# Altium project Dahlia Carrier Board.PrjPcb (part 2 of 4)

## Sheet Power_Switch.SchDoc: Dahlia Carrier Board
size A3; Organization: Toradex AG; Address1: Ebenaustrasse 10; Address2: Horw; Address3: 6048; Address4: Switzerland; DocumentNumber: 4; Revision: V1.1; SheetNumber: 4; SheetTotal: 21; PageSetup: Record=PageOptions|CenterHorizontal=True|CenterVertical=True|PrintScale=0.71|XCorrection=1.00|YCorrection=1.00|PrintKind=1|BorderSize=5000000|LeftOffset=0|BottomOffset=0|Orientation=2|PaperLength=1000|PaperWidth=1000|Scale=100|PaperSource=15|PrintQuality=600|MediaType=1|DitherType=10|PaperKind=A4|PrintScaleMode=1
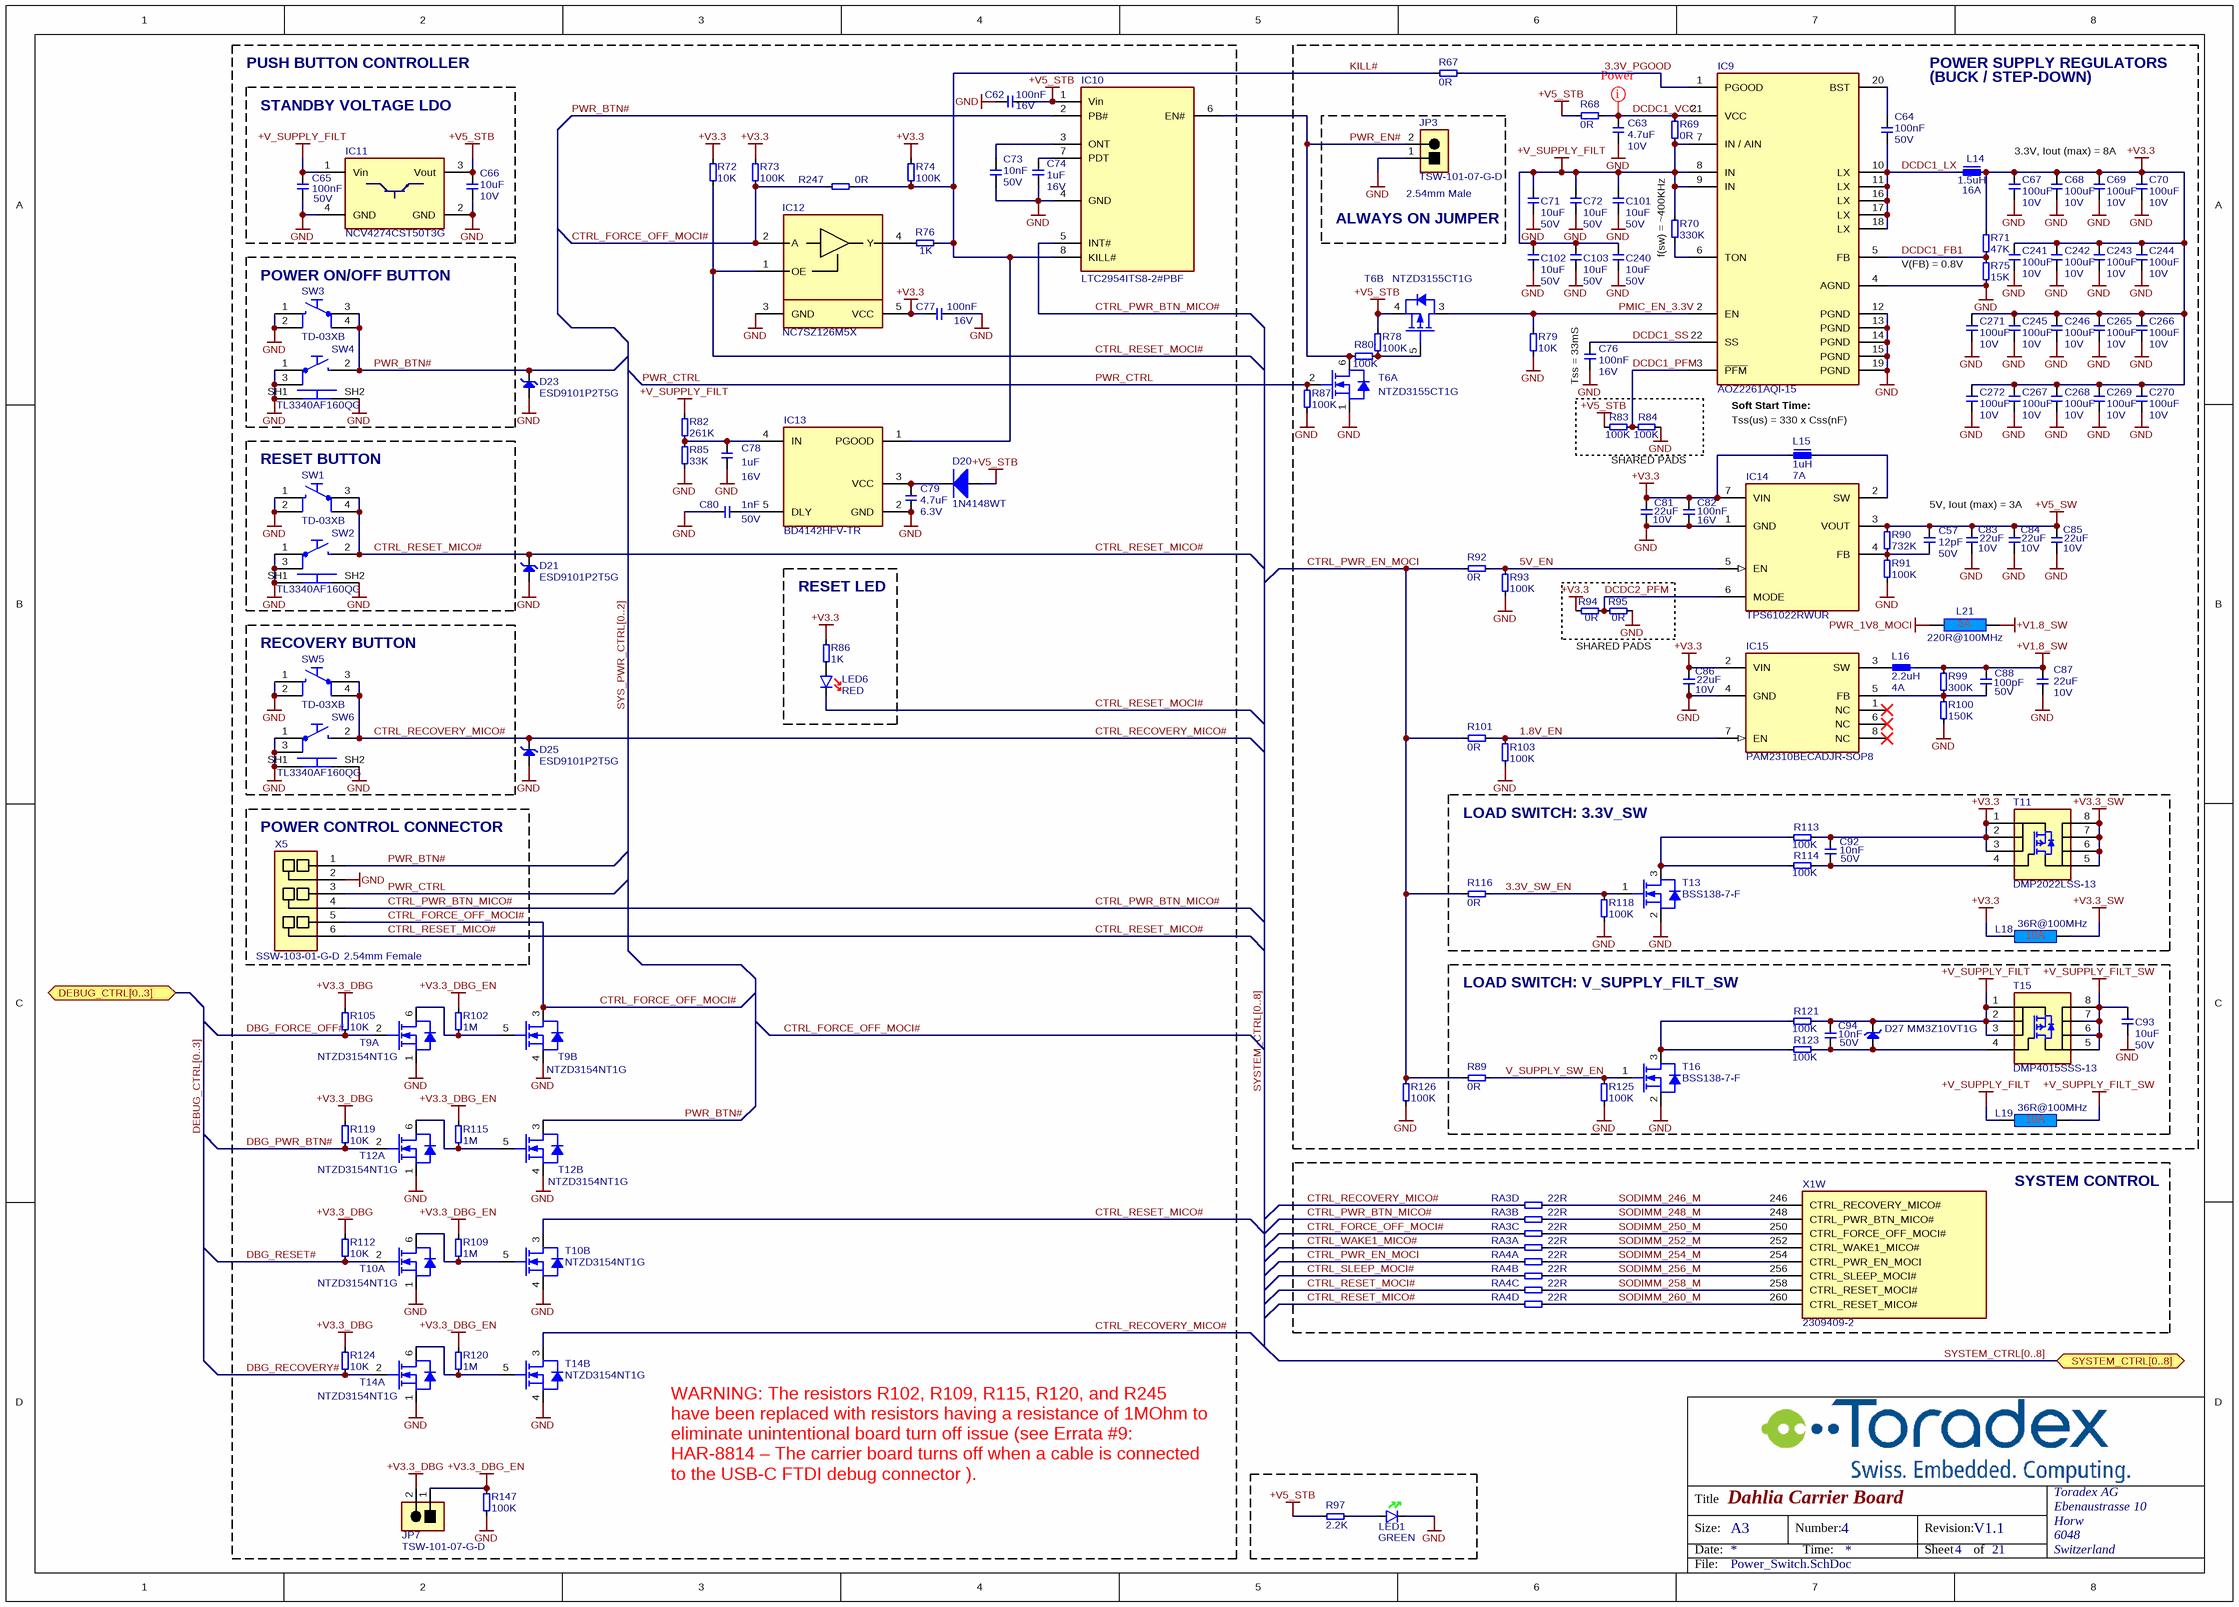
[diagram p6: Power_Switch.SchDoc]

### Parts
C57  Rating: 50V  [CAPC1005X60N]  (hidden comment: 12pF)
C62  Rating: 16V  [CAPC1005X60N]  (hidden comment: 100nF)
C63  Rating: 10V  [T_CAPC0603X33N]  (hidden comment: 4.7uF)
C64  Rating: 50V  [CAPC1005X60N]  (hidden comment: 100nF)
C65  Rating: 50V  [CAPC1005X60N]  (hidden comment: 100nF)
C66  Rating: 10V  [T_CAPC0603X33N]  (hidden comment: 10uF)
C67  Rating: 10V  [T_CAPC1206X60N]  (hidden comment: 100uF)
C68  Rating: 10V  [T_CAPC1206X60N]  (hidden comment: 100uF)
C69  Rating: 10V  [T_CAPC1206X60N]  (hidden comment: 100uF)
C70  Rating: 10V  [T_CAPC1206X60N]  (hidden comment: 100uF)
C71  Rating: 50V  [T_CAPC1206X60N]  (hidden comment: 10uF)
C72  Rating: 50V  [T_CAPC1206X60N]  (hidden comment: 10uF)
C73  Rating: 50V  [CAPC1005X60N]  (hidden comment: 10nF)
C74  Rating: 16V  [CAPC1005X60N]  (hidden comment: 1uF)
C76  Rating: 16V  [CAPC1005X60N]  (hidden comment: 100nF)
C77  Rating: 16V  [CAPC1005X60N]  (hidden comment: 100nF)
C78  Rating: 16V  [CAPC1005X60N]  (hidden comment: 1uF)
C79  Rating: 6.3V  [CAPC1005X60N]  (hidden comment: 4.7uF)
C80  Rating: 50V  [CAPC1005X60N]  (hidden comment: 1nF)
C81  Rating: 10V  [T_CAPC0805X125N]  (hidden comment: 22uF)
C82  Rating: 16V  [CAPC1005X60N]  (hidden comment: 100nF)
C83  Rating: 10V  [T_CAPC0805X125N]  (hidden comment: 22uF)
C84  Rating: 10V  [T_CAPC0805X125N]  (hidden comment: 22uF)
C85  Rating: 10V  [T_CAPC0805X125N]  (hidden comment: 22uF)
C86  Rating: 10V  [T_CAPC0805X125N]  (hidden comment: 22uF)
C87  Rating: 10V  [T_CAPC0805X125N]  (hidden comment: 22uF)
C88  Rating: 50V  [CAPC1005X60N]  (hidden comment: 100pF)
C92  Rating: 50V  [CAPC1005X60N]  (hidden comment: 10nF)
C93  Rating: 50V  [T_CAPC1206X60N]  (hidden comment: 10uF)
C94  Rating: 50V  [CAPC1005X60N]  (hidden comment: 10nF)
C101  Rating: 50V  [T_CAPC1206X60N]  (hidden comment: 10uF)
C102  Rating: 50V  [T_CAPC1206X60N]  (hidden comment: 10uF)
C103  Rating: 50V  [T_CAPC1206X60N]  (hidden comment: 10uF)
C240  Rating: 50V  [T_CAPC1206X60N]  (hidden comment: 10uF)
C241  Rating: 10V  [T_CAPC1206X60N]  (hidden comment: 100uF)
C242  Rating: 10V  [T_CAPC1206X60N]  (hidden comment: 100uF)
C243  Rating: 10V  [T_CAPC1206X60N]  (hidden comment: 100uF)
C244  Rating: 10V  [T_CAPC1206X60N]  (hidden comment: 100uF)
C245  Rating: 10V  [T_CAPC1206X60N]  (hidden comment: 100uF)
C246  Rating: 10V  [T_CAPC1206X60N]  (hidden comment: 100uF)
C265  Rating: 10V  [T_CAPC1206X60N]  (hidden comment: 100uF)
C266  Rating: 10V  [T_CAPC1206X60N]  (hidden comment: 100uF)
C267  Rating: 10V  [T_CAPC1206X60N]  (hidden comment: 100uF)
C268  Rating: 10V  [T_CAPC1206X60N]  (hidden comment: 100uF)
C269  Rating: 10V  [T_CAPC1206X60N]  (hidden comment: 100uF)
C270  Rating: 10V  [T_CAPC1206X60N]  (hidden comment: 100uF)
C271  Rating: 10V  [T_CAPC1206X60N]  (hidden comment: 100uF)
C272  Rating: 10V  [T_CAPC1206X60N]  (hidden comment: 100uF)
D20  1N4148WT  [SOD-523F]
D21  ESD9101P2T5G  [SOD-923]
D23  ESD9101P2T5G  [SOD-923]
D25  ESD9101P2T5G  [SOD-923]
D27  MM3Z10VT1G  [T_SOD-323]
IC9  AOZ2261AQI-15  [T_QFN50P400X400X100-22N]
IC10  LTC2954ITS8-2#PBF  [T_LINEAR_LTC2954CTS8-2#PBF]
IC11  NCV4274CST50T3G  [T_ON_NCV4264-2ST50T3G]
IC12  NC7SZ126M5X  [SOT95P279X142-5N]
IC13  BD4142HFV-TR  [IC-Rohm-BD4142HFV-TR]
IC14  TPS61022RWUR  [T_TI_TPS61022RWUR]
IC15  Manufacturer Part No.: PAM2310BECADJR-SOP8  [IC-SO-8EP]  (hidden comment: PAM2310BECADJR)
JP3  TSW-101-07-G-D  [T_Samtec_TSW-101-07-G-D]
JP7  TSW-101-07-G-D  [T_Samtec_TSW-101-07-G-D]
L14  Rating: 16A  [T_INDM110100]  (hidden comment: 1.5uH)
L15  Rating: 7A  [T_INDM_PA4340]  (hidden comment: 1uH)
L16  Rating: 4A  [IND-BOURNS-SRP4020TA]  (hidden comment: 2.2uH)
L18  36R@100MHz  [T_Laird_35F0121-0SR-10]
L19  36R@100MHz  [T_Laird_35F0121-0SR-10]
L21  220R@100MHz  [INDC1608X95N]
LED1  Color: GREEN  [T_Liteon_LTST-C190GKT]  (hidden comment: LTST-C190GKT)
LED6  Color: RED  [T_Liteon_LTST-C190KRKT]  (hidden comment: LTST-C190KRKT)
R67  0R  [T_RESC0603X30N]
R68  0R  [T_RESC0603X30N]
R69  0R  [T_RESC0603X30N]
R70  330K  [RESC1005X40N]
R71  47K  [RESC1005X40N]
R72  10K  [RESC1005X40N]
R73  100K  [RESC1005X40N]
R74  100K  [RESC1005X40N]
R75  15K  [RESC1005X40N]
R76  1K  [RESC1005X40N]
R78  100K  [RESC1005X40N]
R79  10K  [RESC1005X40N]
R80  100K  [RESC1005X40N]
R82  261K  [RESC1005X40N]
R83  100K  [T_RESC0603X30N]
R84  100K  [T_RESC0603X30N]
R85  33K  [RESC1005X40N]
R86  1K  [RESC1005X40N]
R87  100K  [RESC1005X40N]
R89  0R  [T_RESC0603X30N]
R90  732K  [RESC1005X40N]
R91  100K  [RESC1005X40N]
R92  0R  [T_RESC0603X30N]
R93  100K  [RESC1005X40N]
R94  0R  [T_RESC0603X30N]
R95  0R  [T_RESC0603X30N]
R97  2.2K  [RESC1005X40N]
R99  300K  [RESC1005X40N]
R100  150K  [RESC1005X40N]
R101  0R  [T_RESC0603X30N]
R102  1M  [RESC1005X40N]
R103  100K  [RESC1005X40N]
R105  10K  [RESC1005X40N]
R109  1M  [RESC1005X40N]
R112  10K  [RESC1005X40N]
R113  100K  [RESC1005X40N]
R114  100K  [RESC1005X40N]
R115  1M  [RESC1005X40N]
R116  0R  [T_RESC0603X30N]
R118  100K  [RESC1005X40N]
R119  10K  [RESC1005X40N]
R120  1M  [RESC1005X40N]
R121  100K  [RESC1005X40N]
R123  100K  [RESC1005X40N]
R124  10K  [RESC1005X40N]
R125  100K  [RESC1005X40N]
R126  100K  [RESC1005X40N]
R147  100K  [RESC1005X40N]
R247  0R  [T_RESC0603X30N]
RA3  22R  [T_Resistor_Array_X4]  (parts A,B,C,D of 4)
RA4  22R  [T_Resistor_Array_X4]  (parts A,B,C,D of 4)
SW1  TD-03XB  [T_WMF_TD-03XB]
SW2  TL3340AF160QG  [T_E-SWITCH- TL3340AF160QG]
SW3  TD-03XB  [T_WMF_TD-03XB]
SW4  TL3340AF160QG  [T_E-SWITCH- TL3340AF160QG]
SW5  TD-03XB  [T_WMF_TD-03XB]
SW6  TL3340AF160QG  [T_E-SWITCH- TL3340AF160QG]
T6  NTZD3155CT1G  [SOTFL50P160X60-6N]  (parts A,B of 2)
T9  Manufacturer Part No.: NTZD3154NT1G  [SOTFL50P160X60-6N]  (hidden comment: T-ONSemi-NTZD3154NT1G)  (parts A,B of 2)
T10  Manufacturer Part No.: NTZD3154NT1G  [SOTFL50P160X60-6N]  (hidden comment: T-ONSemi-NTZD3154NT1G)  (parts A,B of 2)
T11  DMP2022LSS-13  [SOIC127P600X173-8N]
T12  Manufacturer Part No.: NTZD3154NT1G  [SOTFL50P160X60-6N]  (hidden comment: T-ONSemi-NTZD3154NT1G)  (parts A,B of 2)
T13  BSS138-7-F  [SOT95P237X112-3N]
T14  Manufacturer Part No.: NTZD3154NT1G  [SOTFL50P160X60-6N]  (hidden comment: T-ONSemi-NTZD3154NT1G)  (parts A,B of 2)
T15  DMP4015SSS-13  [SOIC127P600X173-8N]
T16  BSS138-7-F  [SOT95P237X112-3N]
X1  2309409-2  [CON-TE-2309409-2-SOLDERABLE-STANDOFFS]  (part W of 23)
X5  Manufacturer Part No.: SSW-103-01-G-D  [T_Samtec_SSW-103-01-G-D]  (hidden comment: TSW-103-01-G-D)

### Blocks framed on the sheet
ALWAYS ON JUMPER: JP3
POWER ON/OFF BUTTON: SW3 SW4
Tss = 33mS: R83 R84
RESET BUTTON: SW1 SW2
RESET LED: LED6 R86
RECOVERY BUTTON: SW5 SW6
POWER CONTROL CONNECTOR: X5
LOAD SWITCH: 3.3V_SW: C92 L18 R113 R114 R116 R118 T11 T13
LOAD SWITCH: V_SUPPLY_FILT_SW: C93 C94 D27 L19 R89 R121 R123 R125 T15 T16
SYSTEM CONTROL: RA3 RA4 X1

### Ports
DEBUG_CTRL[0..3] (bidir), SYSTEM_CTRL[0..8] (bidir)

### Nets
+V1.8_SW: C87.2 C88.2 L16.2 L21.2 R99.2
+V3.3: C67.2 C68.2 C69.2 C70.2 C77.1 C81.2 C82.2 C86.2 C92.2 C241.2 C242.2 C243.2 C244.2 C245.2 C246.2 C265.2 C266.2 C267.2 C268.2 C269.2 C270.2 C271.2 C272.2 IC12.5(VCC) IC14.7(VIN) IC15.2(VIN) L14.2 L15.1 L18.1 R71.2 R72.2 R73.2 R74.2 R86.2 R94.1 R113.2 T11.1(S) T11.2(S) T11.3(S)
+V3.3_DBG: JP7.2 R105.2 R112.2 R119.2 R124.2
+V3.3_DBG_EN: JP7.1 R102.2 R109.2 R115.2 R120.2 R147.2
+V3.3_SW: L18.2 T11.5(D) T11.6(D) T11.7(D) T11.8(D)
+V5_STB: C62.2 C66.2 D20.A IC10.1(Vin) IC11.3(Vout) R68.1 R78.1 R83.1 R97.2 T6.4(S)
+V5_SW: C57.1 C83.2 C84.2 C85.2 IC14.3(VOUT) R90.2
+V_SUPPLY_FILT: C65.2 C71.2 C72.2 C94.2 C101.2 C102.2 C103.2 C240.2 D27.1(C) IC9.7(IN_/_AIN) IC9.8(IN) IC9.9(IN) IC11.1(Vin) L19.1 R69.2 R70.2 R82.2 R121.2 T15.1(S) T15.2(S) T15.3(S)
+V_SUPPLY_FILT_SW: C93.2 L19.2 T15.5(D) T15.6(D) T15.7(D) T15.8(D)
GND: C62.1 C63.1 C65.1 C66.1 C67.1 C68.1 C69.1 C70.1 C71.1 C72.1 C73.1 C74.1 C76.1 C77.2 C78.1 C79.1 C80.1 C81.1 C82.1 C83.1 C84.1 C85.1 C86.1 C87.1 C93.1 C101.1 C102.1 C103.1 C240.1 C241.1 C242.1 C243.1 C244.1 C245.1 C246.1 C265.1 C266.1 C267.1 C268.1 C269.1 C270.1 C271.1 C272.1 D21.2(A) D23.2(A) D25.2(A) IC9.4(AGND) IC9.12(PGND) IC9.13(PGND) IC9.14(PGND) IC9.15(PGND) IC9.19(PGND) IC10.4(GND) IC11.2(GND) IC11.4(GND) IC12.3(GND) IC13.2(GND) IC14.1(GND) IC15.4(GND) JP3.1 LED1.K R75.1 R79.1 R84.2 R85.1 R87.1 R91.1 R93.1 R95.2 R100.1 R103.1 R118.1 R125.1 R126.1 R147.1 SW1.1 SW1.2 SW2.1 SW2.3 SW2.SH1 SW2.SH2 SW3.1 SW3.2 SW4.1 SW4.3 SW4.SH1 SW4.SH2 SW5.1 SW5.2 SW6.1 SW6.3 SW6.SH1 SW6.SH2 T6.1(S) T9.1(S) T9.4(S) T10.1(S) T10.4(S) T12.1(S) T12.4(S) T13.2(S) T14.1(S) T14.4(S) T16.2(S) X5.2
PWR_1V8_MOCI: L21.1
1.8V_EN: IC15.7(EN) R101.2 R103.2
3.3V_PGOOD: IC9.1(PGOOD) R67.2
3.3V_SW_EN: R116.2 R118.2 T13.1(G)
5V_EN: IC14.5(EN) R92.2 R93.2
CTRL_FORCE_OFF_MOCI#: IC12.2(A) R73.1 R247.1 RA3.7 T9.3(D) X5.5
CTRL_PWR_BTN_MICO#: IC10.5(INT#) RA3.6 X5.4
CTRL_PWR_EN_MOCI: R89.1 R92.1 R101.1 R116.1 R126.2 RA4.5
CTRL_RECOVERY_MICO#: D25.1(C) RA3.8 SW5.3 SW5.4 SW6.2 T14.3(D)
CTRL_RESET_MICO#: D21.1(C) RA4.8 SW1.3 SW1.4 SW2.2 T10.3(D) X5.6
CTRL_RESET_MOCI#: IC12.1(OE) LED6.K R72.1 RA4.7
CTRL_SLEEP_MOCI#: RA4.6
CTRL_WAKE1_MICO#: RA3.5
DBG_FORCE_OFF#: R105.1 T9.2(G)
DBG_PWR_BTN#: R119.1 T12.2(G)
DBG_RECOVERY#: R124.1 T14.2(G)
DBG_RESET#: R112.1 T10.2(G)
DCDC1_FB1: IC9.5(FB) R71.1 R75.2
DCDC1_LX: C64.1 IC9.10(LX) IC9.11(LX) IC9.16(LX) IC9.17(LX) IC9.18(LX) L14.1
DCDC1_PFM: IC9.3(~{PFM}) R83.2 R84.1
DCDC1_SS: C76.2 IC9.22(SS)
DCDC1_VCC: C63.2 IC9.21(VCC) R68.2 R69.1
DCDC2_PFM: IC14.6(MODE) R94.2 R95.1
KILL#: IC10.8(KILL#) IC13.1(PGOOD) R67.1 R74.1 R76.2 R247.2
PMIC_EN_3.3V: IC9.2(EN) R79.2 T6.3(D)
PWR_BTN#: D23.1(C) IC10.2(PB#) SW3.3 SW3.4 SW4.2 T12.3(D) X5.1
PWR_CTRL: R87.2 T6.2(G) X5.3
PWR_EN#: IC10.6(EN#) JP3.2 R80.1 T6.6(D)
SODIMM_246_M: RA3.4 X1.246(CTRL_RECOVERY_MICO#)
SODIMM_248_M: RA3.2 X1.248(CTRL_PWR_BTN_MICO#)
SODIMM_250_M: RA3.3 X1.250(CTRL_FORCE_OFF_MOCI#)
SODIMM_252_M: RA3.1 X1.252(CTRL_WAKE1_MICO#)
SODIMM_254_M: RA4.1 X1.254(CTRL_PWR_EN_MOCI)
SODIMM_256_M: RA4.2 X1.256(CTRL_SLEEP_MOCI#)
SODIMM_258_M: RA4.3 X1.258(CTRL_RESET_MOCI#)
SODIMM_260_M: RA4.4 X1.260(CTRL_RESET_MICO#)
V_SUPPLY_SW_EN: R89.2 R125.2 T16.1(G)
NetC57_2: C57.2 IC14.4(FB) R90.1 R91.2
NetC64_2: C64.2 IC9.20(BST)
NetC73_2: C73.2 IC10.3(ONT)
NetC74_2: C74.2 IC10.7(PDT)
NetC78_2: C78.2 IC13.4(IN) R82.1 R85.2
NetC79_2: C79.2 D20.C IC13.3(VCC)
NetC80_2: C80.2 IC13.5(DLY)
NetC88_1: C88.1 IC15.5(FB) R99.1 R100.2
NetC92_1: C92.1 R114.2 T11.4(G)
NetC94_1: C94.1 D27.2(A) R123.2 T15.4(G)
NetIC9_6: IC9.6(TON) R70.1
NetIC12_4: IC12.4(Y) R76.1
NetIC14_2: IC14.2(SW) L15.2
NetIC15_3: IC15.3(SW) L16.1
NetLED1_A: LED1.A R97.1
NetLED6_A: LED6.A R86.1
NetR78_2: R78.2 R80.2 T6.5(G)
NetR102_1: R102.1 T9.5(G) T9.6(D)
NetR109_1: R109.1 T10.5(G) T10.6(D)
NetR113_1: R113.1 R114.1 T13.3(D)
NetR115_1: R115.1 T12.5(G) T12.6(D)
NetR120_1: R120.1 T14.5(G) T14.6(D)
NetR121_1: R121.1 R123.1 T16.3(D)

Not connected (* = marked no-connect by the designer): IC15 1(NC)* 6(NC)* 8(NC)*

### Buses and harness runs
bus DEBUG_CTRL[0..3] = port DEBUG_CTRL[0..3]
bus SYS_PWR_CTRL[0..2]
bus SYSTEM_CTRL[0..8] = port SYSTEM_CTRL[0..8]

### Layout directives
net class Power: DCDC1_VCC

### Notes on the sheet
- PUSH BUTTON CONTROLLER
- STANDBY VOLTAGE LDO
- POWER SUPPLY REGULATORS
- (BUCK / STEP-DOWN)
- 3.3V, Iout (max) = 8A
- (near JP3) 2.54mm Male
- (near R70) f(sw) = ~400KHz
- V(FB) = 0.8V
- Soft Start Time:
- SHARED PADS
- Tss(us) = 330 x Css(nF)
- 5V, Iout (max) = 3A
- 2.54mm Female
- WARNING: The resistors R102, R109, R115, R120, and R245 have been replaced with resistors having a resistance of 1MOhm to eliminate unintentional board turn off issue (see Errata #9: HAR-8814 – The carrier board turns off when a cable is connected to the USB-C FTDI debug connector ).
- Title
- Size:
- Date:
- A3
- Number:
- Time:
- Revision:
- Sheet
- of
- File:

### Library data of the parts
C57 = C-NP0-12p-50V-5%-0402: Capacitor Ceramic NP0  12pF 50V 5% 0402; Tolerance: 5%; Type: NP0; Value: 12pF
C62 C76 C77 C82 = C-X7R-100nF-16V-10%-0402: Capacitor Ceramic X7R 100nF 16V 10% 0402; Tolerance: 10%; Type: X7R; Value: 100nF
C63 = C-X5R-4.7uF-10V-10%-0603: Capacitor Ceramic X5R 4.7uF 10V 10% 0603; Tolerance: 10%; Type: X5R; Value: 4.7uF
C64 C65 = C-X7R-100nF-50V-10%-0402: Capacitor Ceramic X7R 100nF 50V 10% 0402; Tolerance: 10%; Type: X7R; Value: 100nF
C66 = C-X5R-10uF-10V-20%-0603: Capacitor Ceramic X5R 10uF 10V 20% 0603; Tolerance: 20%; Type: X5R; Value: 10uF
C67-C70 C241-C246 C265-C272 = C-X5R-100uF-10V-20%-1206: Capacitor Ceramic X5R 100uF 10V 20% 1206; Tolerance: 20%; Type: X5R; Value: 100uF
C71 C72 C93 C101-C103 C240 = C-X5R-10uF-50V-20%-1206: Capacitor Ceramic X5R 10uF 50V 20% 1206; Tolerance: 20%; Type: X5R; Value: 10uF
C73 C92 C94 = C-X7R-10nF-50V-10%-0402: Capacitor Ceramic X7R 10nF 50V 10% 0402; Tolerance: 10%; Type: X7R; Value: 10nF
C74 C78 = C-X5R-1uF-16V-20%-0402: Capacitor Ceramic X5R 1uF 16V 20% 0402; Tolerance: 20%; Type: X5R; Value: 1uF
C79 = C-X5R-4.7u-6.3V-20%-0402: Capacitor Ceramic X5R 4.7uF 6.3V 20% 0402; Tolerance: 20%; Type: X5R; Value: 4.7uF
C80 = C-X7R-1nF-50V-10%-0402: Capacitor Ceramic X7R 1nF 50V 10% 0402; Tolerance: 10%; Type: X7R; Value: 1nF
C81 C83-C87 = C-X5R-22uF-10V-20%-0805: Capacitor Ceramic X5R 22uF 10V 20% 0805; Tolerance: 20%; Type: X5R; Value: 22uF; ClassName: Power_Poly
C88 = C-X7R-100pF-50V-10%-0402: Capacitor Ceramic X7R 100pF 50V 10% 0402; Tolerance: 10%; Type: X7R; Value: 100pF
D20 = D-OnSemi-1N4148WT: Diode Standard 75V 200mA Surface Mount SOD-523F; Manufacturer Name: On Semi; Manufacturer Part No.: 1N4148WT
D21 D23 D25 = D-OnSemi-ESD9101P2T5G: ESD Protection Diode; Manufacturer Name: OnSemi; Manufacturer Part No.: ESD9101P2T5G
D27 = D-OnSemi-MM3Z10VT1G: DIODE ZENER 10V 300MW SOD323; Manufacturer Name: OnSemi; Manufacturer Part No.: MM3Z10VT1G
IC9 = IC-A&O-AOZ2261AQI-15: 8A (Iout(max)) Synchronous Buck Regulator, QFN-22L (4mmx 4mm), Vin = 4V to 28V; Manufacturer Name: Alpha and Omega; Manufacturer Part No.: AOZ2261AQI-15
IC10 = IC-LIN-LTC2954ITS8-2#PBF: Push Button On/Off Controller; Manufacturer Name: Linear; Package: *; Temperature Range: -40 +85; Manufacturer Part No.: LTC2954ITS8-2#PBF
IC11 = IC-ON-NCV4274CST50T3G: LDO regulator, Vout = 5V, Iout(max) = 0.4A, Vin = 5.5V to 40V, SOT-223; Manufacturer Name: ON Semiconductor; Manufacturer Part No.: NCV4274CST50T3G
IC12 = IC-FAR-NC7SZ126M5X: NC7SZ126M5X  Buffer Three-State Output; Manufacturer Name: Fairchild Semiconductor; Manufacturer Part No.: NC7SZ126M5X
IC13 = IC-Rohm-BD4142HFV-TR: Supervisor Open Drain or Open Collector 1 Channel HVSOF5; Manufacturer Name: Rohm; Manufacturer Part No.: BD4142HFV-TR
IC14 = IC-TI-TPS61022RWUR: Integrated Boost Regulator; Manufacturer Name: Texas Instruments; Manufacturer Part No.: TPS61022RWUR
IC15 = IC-DIODES-PAM2310BECADJR-SOP8: Integrated Buck Regulator; Manufacturer Name: Diodes
JP3 JP7 = CON-Samtec-TSW-101-07-G-D: Header male, 1x2 Pins, 2.54 mm pitch; Manufacturer Name: Samtec; Pitch: 2.54 mm; No. of ways: 1x2; Manufacturer Part no.: TSW-101-07-G-D
L14 = L-Pulse-PA4342.152NLT-1.5uH-16A-20%: Inductance 1.5uH, 20%, Irms=16A, Isat=33A, DCR=4.6 mOhm; Manufacturer Name: Pulse; I (saturation): 33A; Tolerance: 20%; Manufacturer Part No.: PA4342.152NLT; I (RMS): 16A; Value: 1.5uH; ClassName: Power_Poly
L15 = L-Pulse-PA4340.102NLT-1uH-7A-20%: Inductance 1uH, 20%, Irms=7A, Isat=11A, DCR=14 mOhm; Manufacturer Name: Pulse; I (saturation): 11A; Tolerance: 20%; Manufacturer Part No.: PA4340.102NLT; I (RMS): 7A; Value: 1uH
L16 = L-Bourns-SRP4020TA-2R2M-2.2uH-4A-20%: 2.2µH Shielded Wirewound Inductor 4A 61mOhm Max 2-SMD; Manufacturer Name: Bourns; Tolerance: 20%; I (saturation): 6A; Manufacturer Part No.: SRP4020TA-2R2M; I (RMS): 4A; Value: 2.2uH; ClassName: Power_Poly
L18 L19 = L-Laird-35F0121-0SR-10-10A-25%: Power Supply FB 10A; Tolerance: 25%; Rating: 10A; Value: 36R@100MHz; ClassName: Power_Poly
L21 = L-220R@100MHz-2A-25%-0603: 220R@100MHz 2A EMI FILTER; Tolerance: 25%; Rating: 2A; Value: 220R@100MHz
LED1 = LED-LiteOn-LTST-C190GKT: LED green Lite-ON LTST-C190GKT; Manufacturer Name: Lite-ON; Manufacturer Part No.: LTST-C190GKT
LED6 = LED-LiteOn-LTST-C190KRKT: LED red, Lite-On LTST-C190KRKT; Manufacturer Part No.: LTST-C190KRKT; Manufacturer Name: Lite-On
R67-R69 R89 R92 R94 R95 R101 R116 R247 = R-0R-63mW-1%-0603: Resistor 0 ohm 63mW 1% 0603; Rating: 63mW; Tolerance: 1%; Value: 0R
R70 = R-330KR-63mW-1%-0402: Resistor 330 Kohm 63mW 1% 0402; Value: 330KR; Rating: 63mW; Tolerance: 1%
R71 = R-47K-63mW-1%-0402: Resistor 47 Kohm 63mW 1% 0402; Rating: 63mW; Tolerance: 1%; Value: 47K
R72 R79 R105 R112 R119 R124 = R-10K-63mW-5%-0402: Resistor 10 Kohm 63mW 5% 0402; Rating: 63mW; Tolerance: 5%; Value: 10K
R73 R74 R78 R80 R87 R93 R103 R113 R114 R118 R121 R123 R125 R126 R147 = R-100K-63mW-5%-0402: Resistor 100 Kohm 63mW 5% 0402; Rating: 63mW; Tolerance: 5%; Value: 100K
R75 = R-15KR-63mW-1%-0402: Resistor 15 Kohm 63mW 1% 0402; Value: 15KR; Rating: 63mW; Tolerance: 1%
R76 R86 = R-1K-63mW-5%-0402: Resistor 1 Kohm 63mW 5% 0402; Rating: 63mW; Tolerance: 5%; Value: 1K
R82 = R-261K-63mW-1%-0402: Resistor 261 Kohm 63mW 1% 0402; Rating: 63mW; Tolerance: 1%; Value: 261K
R83 R84 = R-100K-63mW-5%-0603: Resistor 100 Kohm 63mW 5% 0603; Rating: 63mW; Tolerance: 5%; Value: 100K
R85 = R-33K-63mW-1%-0402: Resistor 33 Kohm 63mW 1% 0402; Rating: 63mW; Tolerance: 1%; Value: 33K
R90 = R-732K-63mW-1%-0402: Resistor 732 Kohm 63mW 1% 0402; Rating: 63mW; Tolerance: 1%; Value: 732K
R91 = R-100K-63mW-1%-0402: Resistor 100 Kohm 63mW 1% 0402; Rating: 63mW; Tolerance: 1%; Value: 100K
R97 = R-2.2K-63mW-5%-0402: Resistor 2.2 Kohm 63mW 5% 0402; Value: 2.2KR; Rating: 63mW; Tolerance: 5%
R99 = R-300K-63mW-1%-0402: Resistor 300 Kohm 63mW 1% 0402; Rating: 63mW; Tolerance: 1%; Value: 300K
R100 = R-150K-63mW-1%-0402: Resistor 150 Kohm 63mW 1% 0402; Value: 150KR; Rating: 63mW; Tolerance: 1%
R102 R109 R115 R120 = R-1M-63mW-5%-0402: Resistor 1 Mohm 63mW 5% 0402; Rating: 63mW; Tolerance: 5%; Value: 1M
RA3 RA4 = RA-22R-63mW-5%-1206-div: Resistor Array 22 R 63mW 5% 1206; Tolerance: 5%; Power Dissipation: 63mW; Value: 22R
SW1 SW3 SW5 = SW-WMF-TD-03XB: Push Button; Manufacturer Name: WMF; Manufacturer Part No.: TD-03XB-Z; Rating: 50mA
SW2 SW4 SW6 = SW-E-Switch-TL3340AF160QG: SWITCH TACT SUB MINI 160GF SMD Right Angle; Manufacturer Name: E-Switch; Manufacturer Part No.: TL3340AF160QG
T6 = T-ONSemi-NTZD3155CT1G: N- and P-Channel MOSFET 20V; Manufacturer Name: ONSemi; Manufacturer Part No.: NTZD3155CT1G
T9 T10 T12 T14 = T-ONSemi-NTZD3154NT1G: Dual N-Channel 20V (D-S)  MOSFET; Manufacturer Name: ONSemi
T11 = T-Diodes-DMP2022LSS-13-8-SOIC: p-channel MOSFET, DMP2022LSS-13; Manufacturer Name: DIODES; Manufacturer Part No.: DMP2022LSS-13; ClassName: Power_Poly
T13 T16 = T-Diodes-BSS138-7-F: N-channel MOSFET, BSS138-7-F; Manufacturer Name: Diodes; Manufacturer Part No.: BSS138-7-F
T15 = T-DiodesInc-DMP4015SSS-13: P-channel MOSFET, DMP4015SSS-13; Manufacturer Name: Diodes Inc; Manufacturer Part No.: DMP4015SSS-13; ClassName: Power_Poly
X1 = CON-TE-2309409-2: DDR4 SODIMM Socket, 260 pins, 5.2mm(H), 0.5mm Pitch; Manufacturer Name: TE; Temperature Range: -40C to +125C; Package: DDR4-SODIMM-260; Manufacturer Part No.: 2309409-2
X5 = CON-Samtec-SSW-103-01-G-D: Receptacle Female Socket, 2x3 Pins, 2.54mm pitch; Manufacturer Name: Samtec; No. of ways: 2x3; Pitch: 2.54mm

## Sheet SDCard.SchDoc: Dahlia Carrier Board
size A3; Organization: Toradex AG; Address1: Ebenaustrasse 10; Address2: Horw; Address3: 6048; Address4: Switzerland; DocumentNumber: 14; Revision: V1.1; SheetNumber: 14; SheetTotal: 21; PageSetup: Record=PageOptions|CenterHorizontal=True|CenterVertical=True|PrintScale=0.71|XCorrection=1.00|YCorrection=1.00|PrintKind=1|BorderSize=5000000|LeftOffset=0|BottomOffset=0|Orientation=2|PaperLength=1000|PaperWidth=1000|Scale=100|PaperSource=15|PrintQuality=600|MediaType=1|DitherType=10|PaperKind=A4|PrintScaleMode=1
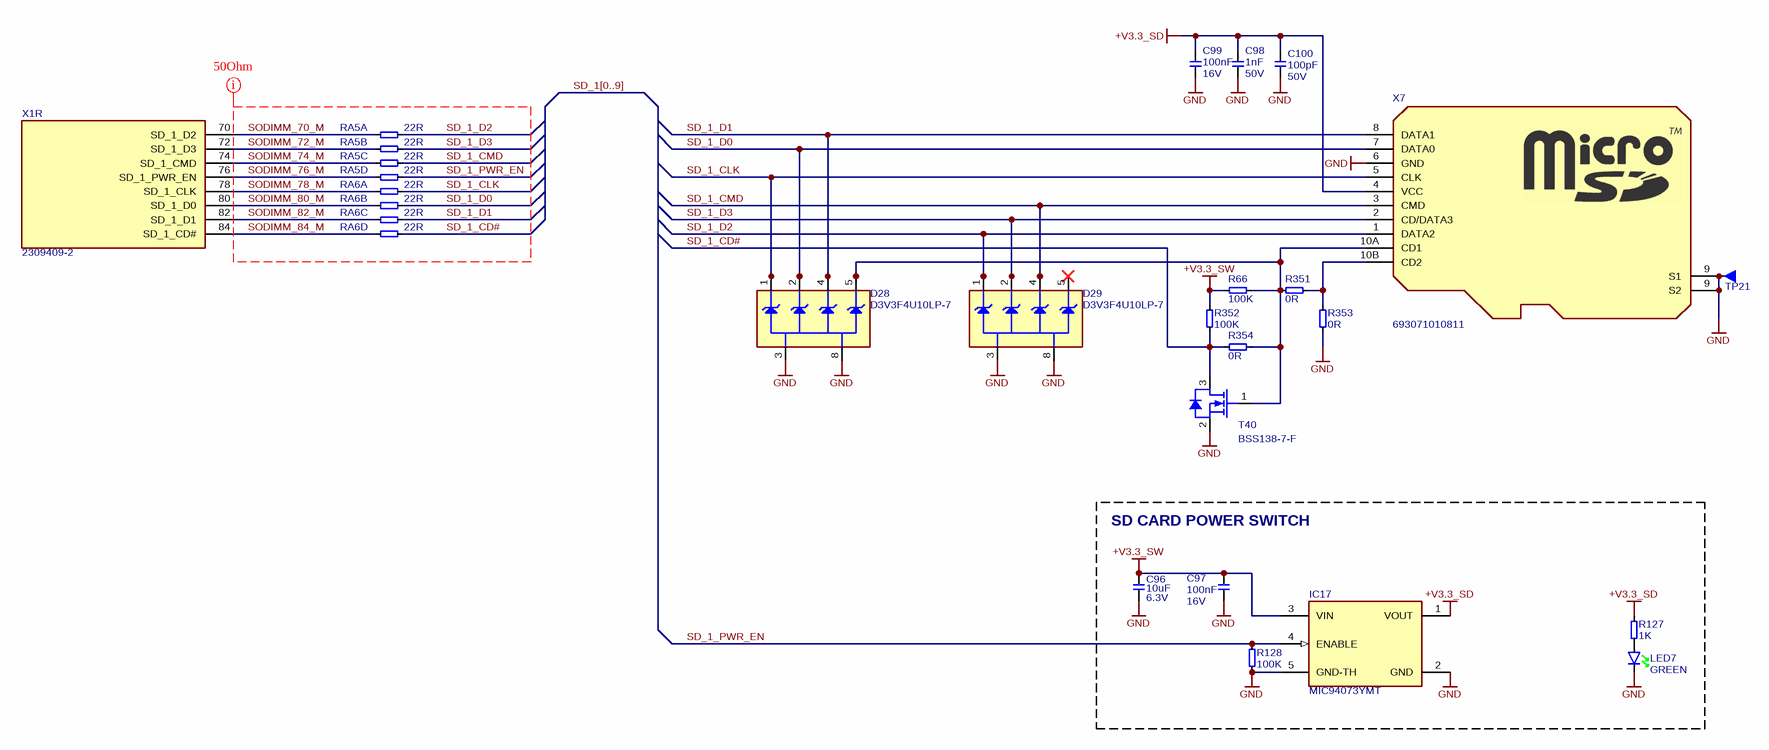
[diagram p7: SDCard.SchDoc]

### Parts
C96  Rating: 6.3V  [CAPC1005X60N]  (hidden comment: 10uF)
C97  Rating: 16V  [CAPC1005X60N]  (hidden comment: 100nF)
C98  Rating: 50V  [CAPC1005X60N]  (hidden comment: 1nF)
C99  Rating: 16V  [CAPC1005X60N]  (hidden comment: 100nF)
C100  Rating: 50V  [CAPC1005X60N]  (hidden comment: 100pF)
D28  D3V3F4U10LP-7  [D-Diodes-D3V3F4U10LP-7]
D29  D3V3F4U10LP-7  [D-Diodes-D3V3F4U10LP-7]
IC17  MIC94073YMT  [T_TDFN0P120X160X60-4N]
LED7  Color: GREEN  [T_Liteon_LTST-C190GKT]  (hidden comment: LTST-C190GKT)
R66  100K  [RESC1005X40N]
R127  1K  [RESC1005X40N]
R128  100K  [RESC1005X40N]
R351  0R  [T_RESC0603X30N]
R352  100K  [RESC1005X40N]
R353  0R  [T_RESC0603X30N]
R354  0R  [T_RESC0603X30N]
RA5  22R  [T_Resistor_Array_X4]  (parts A,B,C,D of 4)
RA6  22R  [T_Resistor_Array_X4]  (parts A,B,C,D of 4)
T40  BSS138-7-F  [SOT95P237X112-3N]
TP21  Testpin-THT  [T_TP-THT]  (value not drawn)  (no BOM)
X1  2309409-2  [CON-TE-2309409-2-SOLDERABLE-STANDOFFS]  (part R of 23)
X7  Manufacturer Part No.: 693071010811  [T_Wurth_693071010811]  (hidden comment: MicroSD Holder)

### Blocks framed on the sheet
SD CARD POWER SWITCH: C96 C97 IC17 LED7 R127 R128

### Nets
+V3.3_SD: C98.2 C99.2 C100.2 IC17.1(VOUT) R127.2 X7.4(VCC)
+V3.3_SW: C96.2 C97.2 IC17.3(VIN) R66.2 R352.1
GND: C96.1 C97.1 C98.1 C99.1 C100.1 D28.3 D28.8 D29.3 D29.8 IC17.2(GND) IC17.5(GND-TH) LED7.K R128.1 R353.1 T40.2(S) TP21.1 X7.6(GND) X7.9(S1)
SD_1_CD#: R352.2 R354.2 RA6.8 T40.3(D)
SD_1_CLK: D28.1 D28.10 RA6.5 X7.5(CLK)
SD_1_CMD: D29.4 D29.7 RA5.7 X7.3(CMD)
SD_1_D0: D28.2 D28.9 RA6.6 X7.7(DATA0)
SD_1_D1: D28.4 D28.7 RA6.7 X7.8(DATA1)
SD_1_D2: D29.1 D29.10 RA5.5 X7.1(DATA2)
SD_1_D3: D29.2 D29.9 RA5.6 X7.2(CD/DATA3)
SD_1_PWR_EN: IC17.4(ENABLE) R128.2 RA5.8
SODIMM_70_M: RA5.1 X1.70(SD_1_D2)
SODIMM_72_M: RA5.2 X1.72(SD_1_D3)
SODIMM_74_M: RA5.3 X1.74(SD_1_CMD)
SODIMM_76_M: RA5.4 X1.76(SD_1_PWR_EN)
SODIMM_78_M: RA6.1 X1.78(SD_1_CLK)
SODIMM_80_M: RA6.2 X1.80(SD_1_D0)
SODIMM_82_M: RA6.3 X1.82(SD_1_D1)
SODIMM_84_M: RA6.4 X1.84(SD_1_CD#)
NetD28_5: D28.5 D28.6 R66.1 R351.2 R354.1 T40.1(G) X7.10A(CD1)
NetD29_5: D29.5 D29.6
NetLED7_A: LED7.A R127.1
NetR351_1: R351.1 R353.2 X7.10B(CD2)

### Buses and harness runs
bus SD_1[0..9]

### Layout directives
net class 50Ohm: SD_1_CD#, SD_1_CLK, SD_1_CMD, SD_1_D0, SD_1_D1, SD_1_D2, SD_1_D3, SD_1_PWR_EN, SODIMM_70_M, SODIMM_72_M, SODIMM_74_M, SODIMM_76_M, SODIMM_78_M, SODIMM_80_M, SODIMM_82_M, SODIMM_84_M

### Notes on the sheet
- Title
- Size:
- Date:
- A3
- Number:
- Time:
- Revision:
- Sheet
- of
- File:

### Library data of the parts
C96 = C-X5R-10u-6.3V-20%-0402: Capacitor Ceramic X5R 10uF 6.3V 20% 0402; Tolerance: 20%; Type: X5R; Value: 10uF
C97 C99 = C-X7R-100nF-16V-10%-0402: Capacitor Ceramic X7R 100nF 16V 10% 0402; Tolerance: 10%; Type: X7R; Value: 100nF
C98 = C-X7R-1nF-50V-10%-0402: Capacitor Ceramic X7R 1nF 50V 10% 0402; Tolerance: 10%; Type: X7R; Value: 1nF
C100 = C-X7R-100pF-50V-10%-0402: Capacitor Ceramic X7R 100pF 50V 10% 0402; Tolerance: 10%; Type: X7R; Value: 100pF
D28 D29 = D-Diodes-D3V3F4U10LP-7: 4 CHANNEL LOW CAPACITANCE TVS DIODE ARRAY; Manufacturer Name: Nexperia; Manufacturer Part No.: D3V3F4U10LP-7
IC17 = IC-Microchip-MIC94073YMT: High Side Load Switch, TDFN4 1.2 x 1.6; Manufacturer Name: Microchip; Package: TDFN-4; Manufacturer Part No.: MIC94073YMT
LED7 = LED-LiteOn-LTST-C190GKT: LED green Lite-ON LTST-C190GKT; Manufacturer Name: Lite-ON; Manufacturer Part No.: LTST-C190GKT
R66 R128 R352 = R-100K-63mW-5%-0402: Resistor 100 Kohm 63mW 5% 0402; Rating: 63mW; Tolerance: 5%; Value: 100K
R127 = R-1K-63mW-5%-0402: Resistor 1 Kohm 63mW 5% 0402; Rating: 63mW; Tolerance: 5%; Value: 1K
R351 R353 R354 = R-0R-63mW-1%-0603: Resistor 0 ohm 63mW 1% 0603; Rating: 63mW; Tolerance: 1%; Value: 0R
RA5 RA6 = RA-22R-63mW-5%-1206-div: Resistor Array 22 R 63mW 5% 1206; Tolerance: 5%; Power Dissipation: 63mW; Value: 22R
T40 = T-Diodes-BSS138-7-F: as T13 on sheet Power_Switch; Manufacturer Part No.: BSS138-7-F
TP21 = Testpin-THT: Testpin THT
X1 = CON-TE-2309409-2: as X1 on sheet Power_Switch; Temperature Range: -40C to +125C; Package: DDR4-SODIMM-260; Manufacturer Part No.: 2309409-2
X7 = CON-Wurth-693071010811: Micro SD Holder Push Push CD; Manufacturer Name: Wurth; No. of ways: 9

## Sheet JTAG.SchDoc: Dahlia Carrier Board
size A3; Organization: Toradex AG; Address1: Ebenaustrasse 10; Address2: Horw; Address3: 6048; Address4: Switzerland; DocumentNumber: 12; Revision: V1.1; SheetNumber: 12; SheetTotal: 21; PageSetup: Record=PageOptions|CenterHorizontal=True|CenterVertical=True|PrintScale=0.71|XCorrection=1.00|YCorrection=1.00|PrintKind=1|BorderSize=5000000|LeftOffset=0|BottomOffset=0|Orientation=2|PaperLength=1000|PaperWidth=1000|Scale=100|PaperSource=15|PrintQuality=600|MediaType=1|DitherType=10|PaperKind=A4|PrintScaleMode=1
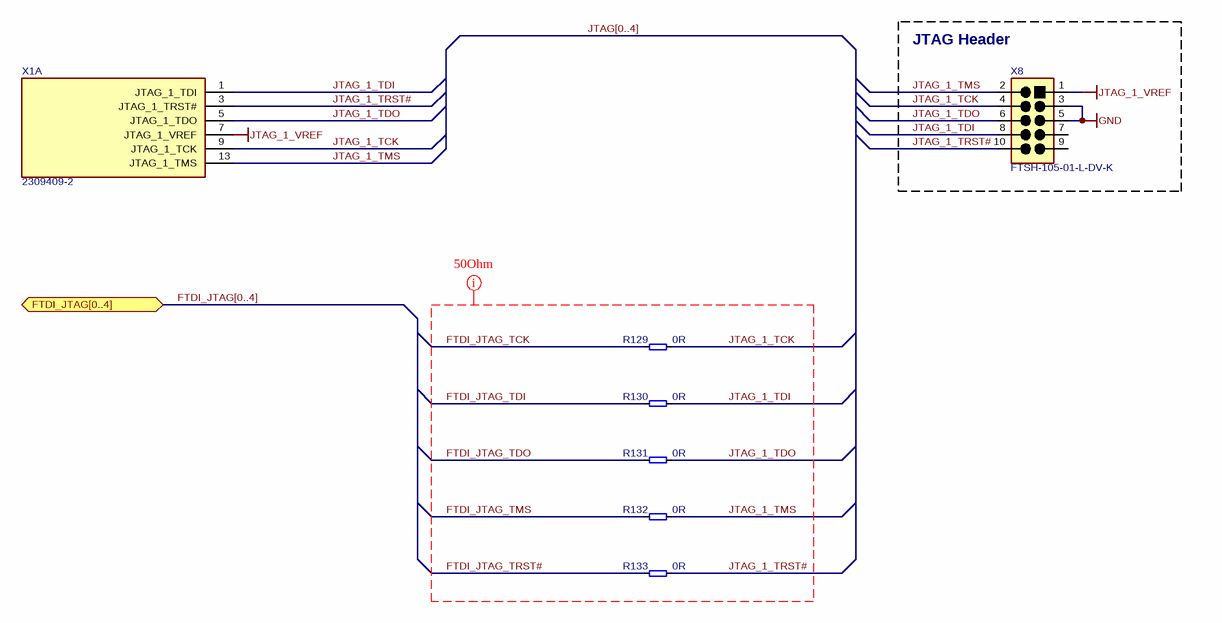
[diagram p8: JTAG.SchDoc]

### Parts
R129  0R  [T_RESC0603X30N]
R130  0R  [T_RESC0603X30N]
R131  0R  [T_RESC0603X30N]
R132  0R  [T_RESC0603X30N]
R133  0R  [T_RESC0603X30N]
X1  2309409-2  [CON-TE-2309409-2-SOLDERABLE-STANDOFFS]  (part A of 23)
X8  FTSH-105-01-L-DV-K  [T_Samtec_FTSH-105-01-L-DV]

### Blocks framed on the sheet
JTAG Header: X8

### Ports
FTDI_JTAG[0..4] (bidir)

### Nets
GND: X8.3 X8.5
JTAG_1_VREF: X1.7(JTAG_1_VREF) X8.1
FTDI_JTAG_TCK: R129.1
FTDI_JTAG_TDI: R130.1
FTDI_JTAG_TDO: R131.1
FTDI_JTAG_TMS: R132.1
FTDI_JTAG_TRST#: R133.1
JTAG_1_TCK: R129.2 X1.9(JTAG_1_TCK) X8.4
JTAG_1_TDI: R130.2 X1.1(JTAG_1_TDI) X8.8
JTAG_1_TDO: R131.2 X1.5(JTAG_1_TDO) X8.6
JTAG_1_TMS: R132.2 X1.13(JTAG_1_TMS) X8.2
JTAG_1_TRST#: R133.2 X1.3(JTAG_1_TRST#) X8.10

Not connected (* = marked no-connect by the designer): X8 7 9

### Buses and harness runs
bus FTDI_JTAG[0..4] = port FTDI_JTAG[0..4]
bus JTAG[0..4]

### Layout directives
net class 50Ohm: FTDI_JTAG_TCK, FTDI_JTAG_TDI, FTDI_JTAG_TDO, FTDI_JTAG_TMS, FTDI_JTAG_TRST#, JTAG_1_TCK, JTAG_1_TDI, JTAG_1_TDO, JTAG_1_TMS, JTAG_1_TRST#

### Notes on the sheet
- Title
- Size:
- Date:
- A3
- Number:
- Time:
- Revision:
- Sheet
- of
- File:

### Library data of the parts
R129-R133 = R-0R-63mW-1%-0603: Resistor 0 ohm 63mW 1% 0603; Rating: 63mW; Tolerance: 1%; Value: 0R
X1 = CON-TE-2309409-2: as X1 on sheet Power_Switch; Temperature Range: -40C to +125C; Package: DDR4-SODIMM-260; Manufacturer Part No.: 2309409-2
X8 = CON-Samtec-FTSH-105-01-L-DV-1X10-1.27mm: Male Header, 10-Pin, 1.27mm Pitch; Manufacturer Name: Samtec; No. of ways: 1X10; Pitch: 1.27mm; Manufacturer Part No.: FTSH-105-01-L-DV-K

## Sheet Power_Supply.SchDoc: Dahlia Carrier Board
size A3; Organization: Toradex AG; Address1: Ebenaustrasse 10; Address2: Horw; Address3: 6048; Address4: Switzerland; DocumentNumber: 3; Revision: V1.1; SheetNumber: 3; SheetTotal: 21; PageSetup: Record=PageOptions|CenterHorizontal=True|CenterVertical=True|PrintScale=0.71|XCorrection=1.00|YCorrection=1.00|PrintKind=1|BorderSize=5000000|LeftOffset=0|BottomOffset=0|Orientation=2|PaperLength=1000|PaperWidth=1000|Scale=100|PaperSource=15|PrintQuality=600|MediaType=1|DitherType=10|PaperKind=A4|PrintScaleMode=1
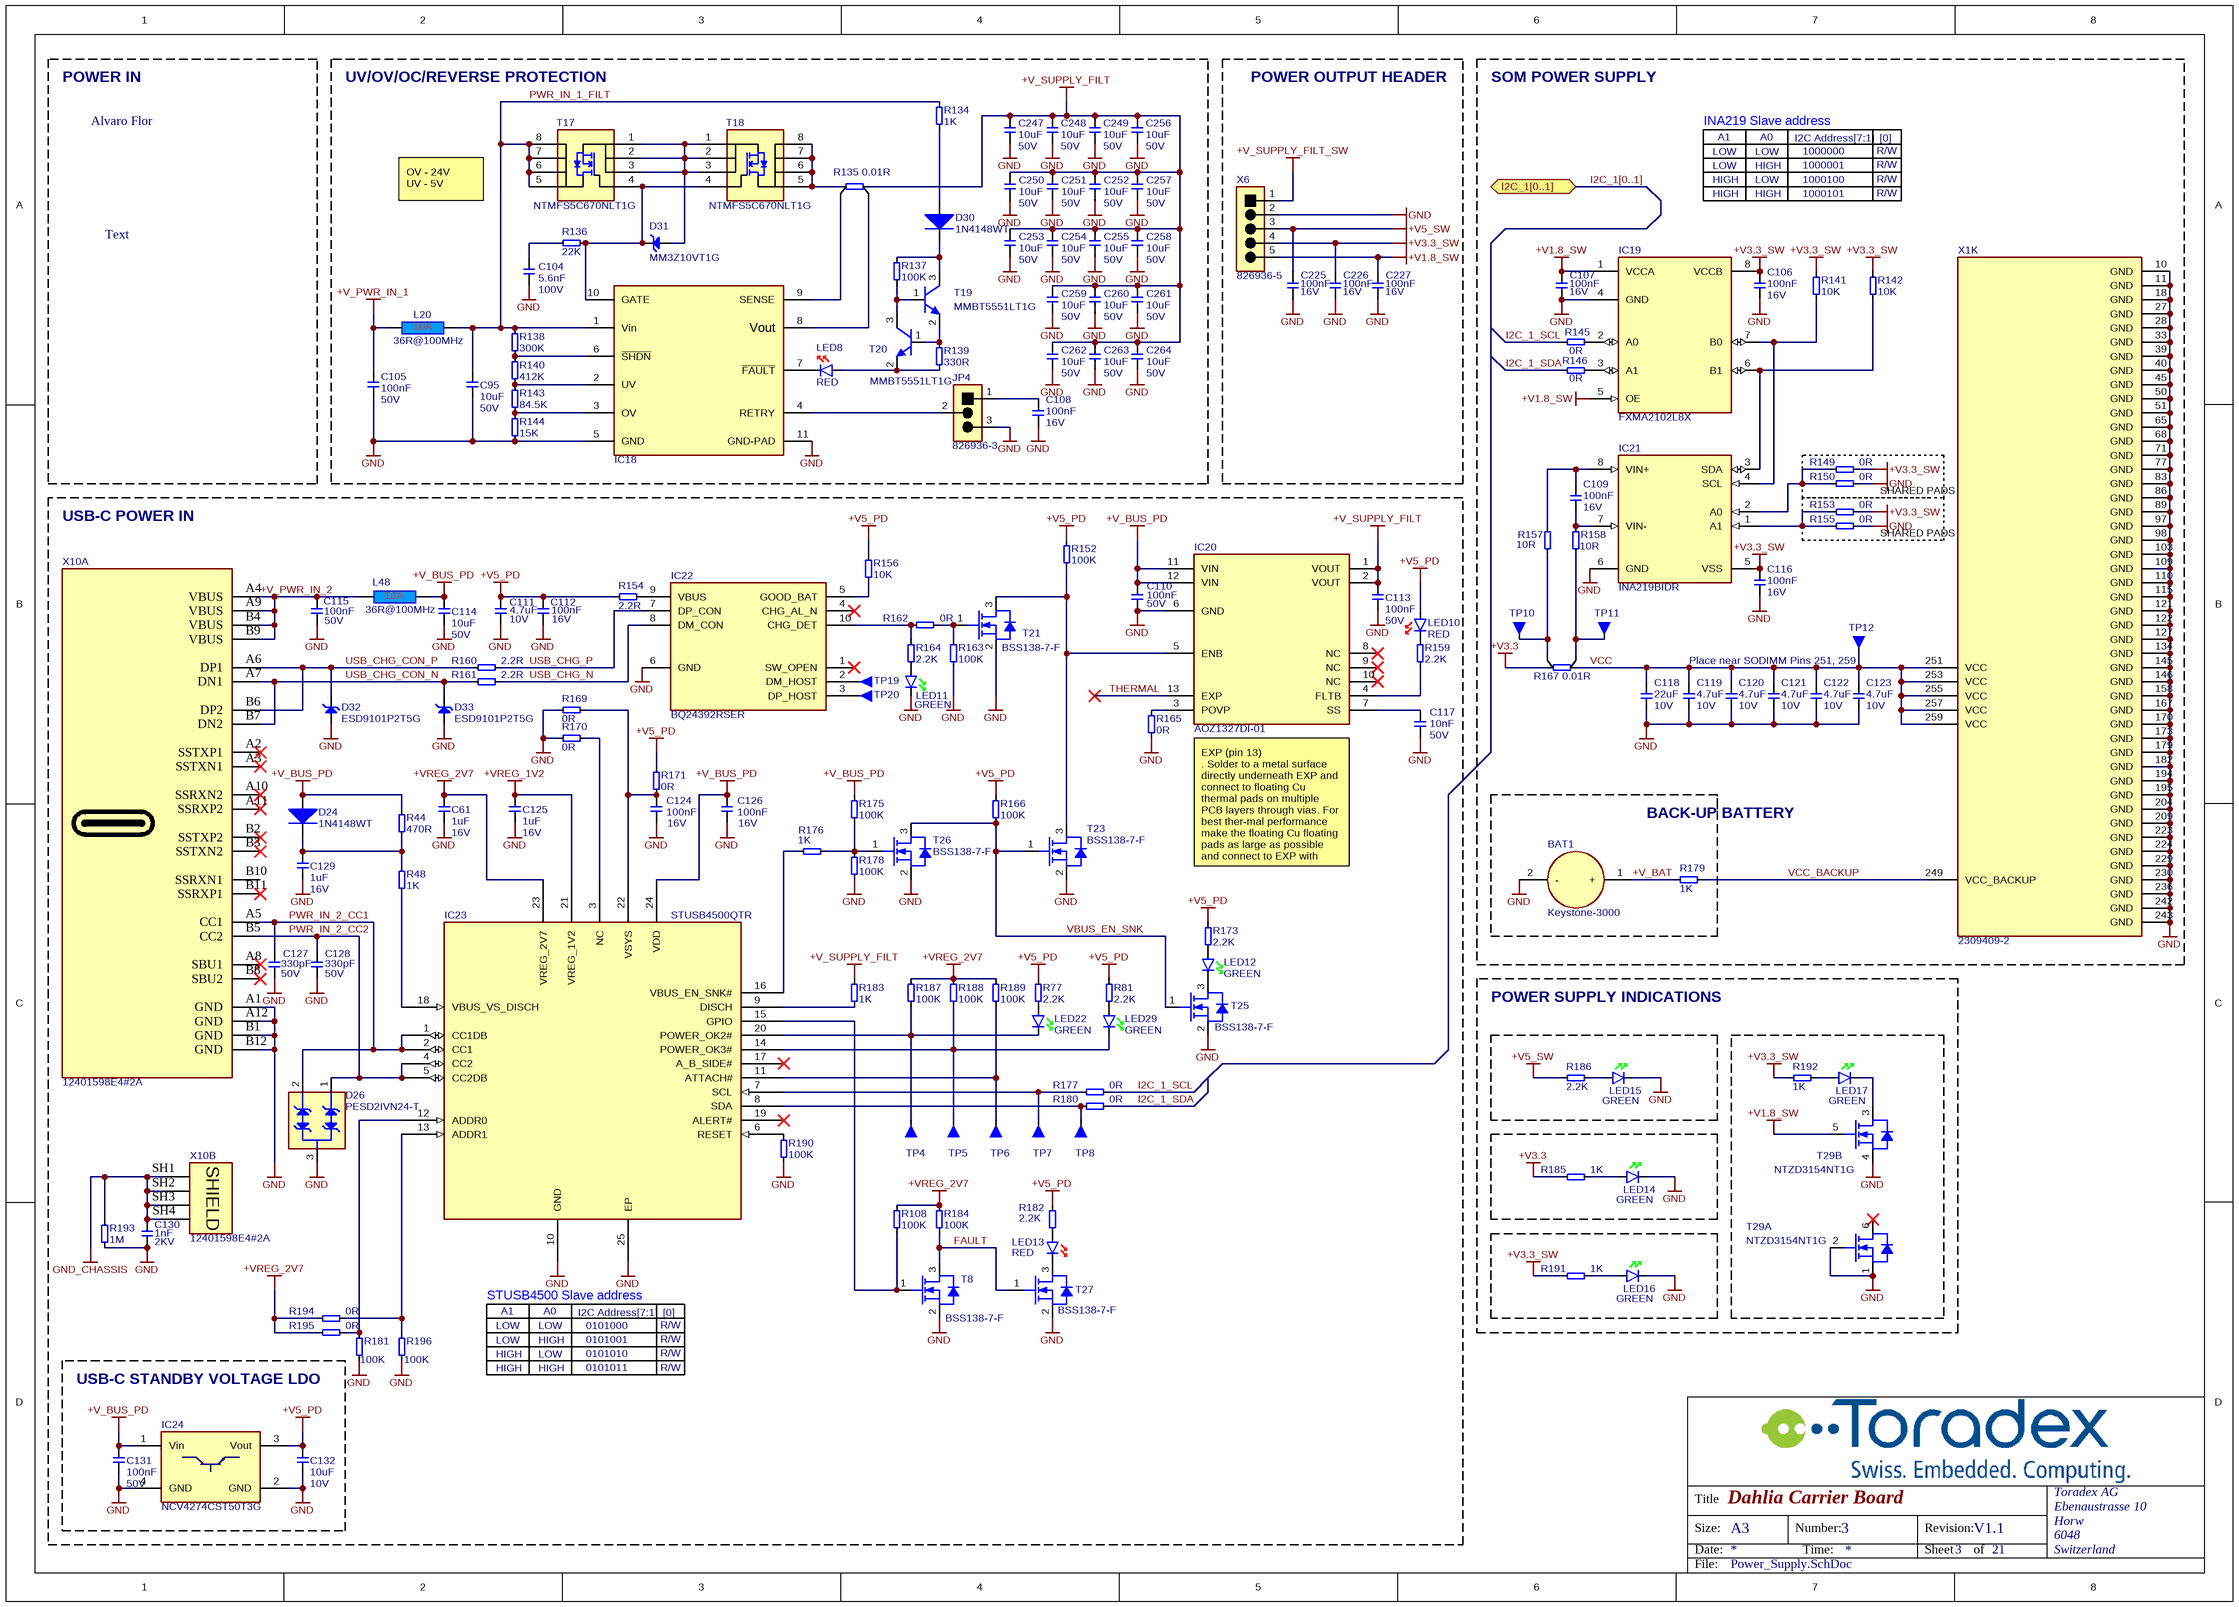
[diagram p9: Power_Supply.SchDoc]

### Parts
BAT1  Keystone-3000  [T_Keystone_3000]
C61  Rating: 16V  [CAPC1005X60N]  (hidden comment: 1uF)
C95  Rating: 50V  [T_CAPC1206X60N]  (hidden comment: 10uF)
C104  Rating: 100V  [T_CAPC1206X180N]  (hidden comment: 5.6nF)
C105  Rating: 50V  [CAPC1005X60N]  (hidden comment: 100nF)
C106  Rating: 16V  [CAPC1005X60N]  (hidden comment: 100nF)
C107  Rating: 16V  [CAPC1005X60N]  (hidden comment: 100nF)
C108  Rating: 16V  [CAPC1005X60N]  (hidden comment: 100nF)
C109  Rating: 16V  [CAPC1005X60N]  (hidden comment: 100nF)
C110  Rating: 50V  [CAPC1005X60N]  (hidden comment: 100nF)
C111  Rating: 10V  [T_CAPC0603X33N]  (hidden comment: 4.7uF)
C112  Rating: 16V  [CAPC1005X60N]  (hidden comment: 100nF)
C113  Rating: 50V  [CAPC1005X60N]  (hidden comment: 100nF)
C114  Rating: 50V  [T_CAPC1206X60N]  (hidden comment: 10uF)
C115  Rating: 50V  [CAPC1005X60N]  (hidden comment: 100nF)
C116  Rating: 16V  [CAPC1005X60N]  (hidden comment: 100nF)
C117  Rating: 50V  [CAPC1005X60N]  (hidden comment: 10nF)
C118  Rating: 10V  [T_CAPC0805X125N]  (hidden comment: 22uF)
C119  Rating: 10V  [T_CAPC0603X33N]  (hidden comment: 4.7uF)
C120  Rating: 10V  [T_CAPC0603X33N]  (hidden comment: 4.7uF)
C121  Rating: 10V  [T_CAPC0603X33N]  (hidden comment: 4.7uF)
C122  Rating: 10V  [T_CAPC0603X33N]  (hidden comment: 4.7uF)
C123  Rating: 10V  [T_CAPC0603X33N]  (hidden comment: 4.7uF)
C124  Rating: 16V  [CAPC1005X60N]  (hidden comment: 100nF)
C125  Rating: 16V  [CAPC1005X60N]  (hidden comment: 1uF)
C126  Rating: 16V  [CAPC1005X60N]  (hidden comment: 100nF)
C127  Rating: 50V  [CAPC1005X60N]  (hidden comment: 330pF)
C128  Rating: 50V  [CAPC1005X60N]  (hidden comment: 330pF)
C129  Rating: 16V  [CAPC1005X60N]  (hidden comment: 1uF)
C130  Rating: 2KV  [T_CAPC1206X180N]  (hidden comment: 1nF)
C131  Rating: 50V  [CAPC1005X60N]  (hidden comment: 100nF)
C132  Rating: 10V  [T_CAPC0603X33N]  (hidden comment: 10uF)
C225  Rating: 16V  [CAPC1005X60N]  (hidden comment: 100nF)
C226  Rating: 16V  [CAPC1005X60N]  (hidden comment: 100nF)
C227  Rating: 16V  [CAPC1005X60N]  (hidden comment: 100nF)
C247  Rating: 50V  [T_CAPC1206X60N]  (hidden comment: 10uF)
C248  Rating: 50V  [T_CAPC1206X60N]  (hidden comment: 10uF)
C249  Rating: 50V  [T_CAPC1206X60N]  (hidden comment: 10uF)
C250  Rating: 50V  [T_CAPC1206X60N]  (hidden comment: 10uF)
C251  Rating: 50V  [T_CAPC1206X60N]  (hidden comment: 10uF)
C252  Rating: 50V  [T_CAPC1206X60N]  (hidden comment: 10uF)
C253  Rating: 50V  [T_CAPC1206X60N]  (hidden comment: 10uF)
C254  Rating: 50V  [T_CAPC1206X60N]  (hidden comment: 10uF)
C255  Rating: 50V  [T_CAPC1206X60N]  (hidden comment: 10uF)
C256  Rating: 50V  [T_CAPC1206X60N]  (hidden comment: 10uF)
C257  Rating: 50V  [T_CAPC1206X60N]  (hidden comment: 10uF)
C258  Rating: 50V  [T_CAPC1206X60N]  (hidden comment: 10uF)
C259  Rating: 50V  [T_CAPC1206X60N]  (hidden comment: 10uF)
C260  Rating: 50V  [T_CAPC1206X60N]  (hidden comment: 10uF)
C261  Rating: 50V  [T_CAPC1206X60N]  (hidden comment: 10uF)
C262  Rating: 50V  [T_CAPC1206X60N]  (hidden comment: 10uF)
C263  Rating: 50V  [T_CAPC1206X60N]  (hidden comment: 10uF)
C264  Rating: 50V  [T_CAPC1206X60N]  (hidden comment: 10uF)
D24  1N4148WT  [SOD-523F]
D26  PESD2IVN24-T  [SOT95P230X110-3N]
D30  1N4148WT  [SOD-523F]
D31  MM3Z10VT1G  [T_SOD-323]
D32  ESD9101P2T5G  [SOD-923]
D33  ESD9101P2T5G  [SOD-923]
IC18  LTC4368IDD-2#PBF  [IC-DFN50P300X300X75-10N]  (value not drawn)
IC19  FXMA2102L8X  [IC-MicroPak50P160X2160X55-8N]
IC20  AOZ1327DI-01  [IC-A&O-AOZ1327DI-01]
IC21  Manufacturer Part No.: INA219BIDR  [SOIC127P600X173-8N]  (hidden comment: INA219)
IC22  BQ24392RSER  [IC-TI-BQ24392RSER]
IC23  STUSB4500QTR  [T_STUSB4500QTR]
IC24  NCV4274CST50T3G  [T_ON_NCV4264-2ST50T3G]
JP4  826936-3  [T_TYCO_826936-3]
L20  36R@100MHz  [T_Laird_35F0121-0SR-10]
L48  36R@100MHz  [T_Laird_35F0121-0SR-10]
LED8  Color: RED  [T_Liteon_LTST-C190KRKT]  (hidden comment: LTST-C190KRKT)
LED10  Color: RED  [T_Liteon_LTST-C190KRKT]  (hidden comment: LTST-C190KRKT)
LED11  Color: GREEN  [T_Liteon_LTST-C190GKT]  (hidden comment: LTST-C190GKT)
LED12  Color: GREEN  [T_Liteon_LTST-C190GKT]  (hidden comment: LTST-C190GKT)
LED13  Color: RED  [T_Liteon_LTST-C190KRKT]  (hidden comment: LTST-C190KRKT)
LED14  Color: GREEN  [T_Liteon_LTST-C190GKT]  (hidden comment: LTST-C190GKT)
LED15  Color: GREEN  [T_Liteon_LTST-C190GKT]  (hidden comment: LTST-C190GKT)
LED16  Color: GREEN  [T_Liteon_LTST-C190GKT]  (hidden comment: LTST-C190GKT)
LED17  Color: GREEN  [T_Liteon_LTST-C190GKT]  (hidden comment: LTST-C190GKT)
LED22  Color: GREEN  [T_Liteon_LTST-C190GKT]  (hidden comment: LTST-C190GKT)
LED29  Color: GREEN  [T_Liteon_LTST-C190GKT]  (hidden comment: LTST-C190GKT)
R44  470R  [T_RESC0603X30N]
R48  1K  [T_RESC0603X30N]
R77  2.2K  [RESC1005X40N]
R81  2.2K  [RESC1005X40N]
R108  100K  [RESC1005X40N]
R134  1K  [RESC1005X40N]
R135  0.01R  [RESWSK1206]
R136  22K  [RESC3216X75N]
R137  100K  [RESC1005X40N]
R138  300K  [RESC3216X75N]
R139  330R  [RESC1005X40N]
R140  412K  [RESC3216X75N]
R141  10K  [RESC1005X40N]
R142  10K  [RESC1005X40N]
R143  84.5K  [RESC3216X75N]
R144  15K  [RESC3216X75N]
R145  0R  [T_RESC0603X30N]
R146  0R  [T_RESC0603X30N]
R149  0R  [T_RESC0603X30N]
R150  0R  [T_RESC0603X30N]
R152  100K  [RESC1005X40N]
R153  0R  [T_RESC0603X30N]
R154  2.2R  [T_RESC0603X30N]
R155  0R  [T_RESC0603X30N]
R156  10K  [RESC1005X40N]
R157  10R  [RESC1005X40N]
R158  10R  [RESC1005X40N]
R159  2.2K  [RESC1005X40N]
R160  2.2R  [T_RESC0603X30N]
R161  2.2R  [T_RESC0603X30N]
R162  0R  [T_RESC0603X30N]
R163  100K  [RESC1005X40N]
R164  2.2K  [RESC1005X40N]
R165  0R  [T_RESC0603X30N]
R166  100K  [RESC1005X40N]
R167  0.01R  [RESWSK1206]
R169  0R  [T_RESC0603X30N]
R170  0R  [T_RESC0603X30N]
R171  0R  [T_RESC0603X30N]
R173  2.2K  [RESC1005X40N]
R175  100K  [RESC1005X40N]
R176  1K  [T_RESC0603X30N]
R177  0R  [T_RESC0603X30N]
R178  100K  [RESC1005X40N]
R179  1K  [RESC1005X40N]
R180  0R  [T_RESC0603X30N]
R181  100K  [RESC1005X40N]
R182  2.2K  [RESC1005X40N]
R183  1K  [T_RESC0603X30N]
R184  100K  [RESC1005X40N]
R185  1K  [RESC1005X40N]
R186  2.2K  [RESC1005X40N]
R187  100K  [RESC1005X40N]
R188  100K  [RESC1005X40N]
R189  100K  [RESC1005X40N]
R190  100K  [RESC1005X40N]
R191  1K  [RESC1005X40N]
R192  1K  [RESC1005X40N]
R193  1M  [RESC3216X75N]
R194  0R  [T_RESC0603X30N]
R195  0R  [T_RESC0603X30N]
R196  100K  [RESC1005X40N]
T8  BSS138-7-F  [SOT95P237X112-3N]
T17  NTMFS5C670NLT1G  [T_ONSemi_NTMFS5C670NLT1G]
T18  NTMFS5C670NLT1G  [T_ONSemi_NTMFS5C670NLT1G]
T19  MMBT5551LT1G  [ONSC-SOT-23-3-318-08_V]
T20  MMBT5551LT1G  [ONSC-SOT-23-3-318-08_V]
T21  BSS138-7-F  [SOT95P237X112-3N]
T23  BSS138-7-F  [SOT95P237X112-3N]
T25  BSS138-7-F  [SOT95P237X112-3N]
T26  BSS138-7-F  [SOT95P237X112-3N]
T27  BSS138-7-F  [SOT95P237X112-3N]
T29  Manufacturer Part No.: NTZD3154NT1G  [SOTFL50P160X60-6N]  (hidden comment: T-ONSemi-NTZD3154NT1G)  (parts A,B of 2)
TP4  Testpin-THT  [T_TP-THT]  (value not drawn)  (no BOM)
TP5  Testpin-THT  [T_TP-THT]  (value not drawn)  (no BOM)
TP6  Testpin-THT  [T_TP-THT]  (value not drawn)  (no BOM)
TP7  Testpin-THT  [T_TP-THT]  (value not drawn)  (no BOM)
TP8  Testpin-THT  [T_TP-THT]  (value not drawn)  (no BOM)
TP10  Testpin-THT  [T_TP-THT]  (value not drawn)  (no BOM)
TP11  Testpin-THT  [T_TP-THT]  (value not drawn)  (no BOM)
TP12  Testpin-THT  [T_TP-THT]  (value not drawn)  (no BOM)
TP19  Testpin-THT  [T_TP-THT]  (value not drawn)  (no BOM)
TP20  Testpin-THT  [T_TP-THT]  (value not drawn)  (no BOM)
X1  2309409-2  [CON-TE-2309409-2-SOLDERABLE-STANDOFFS]  (part K of 23)
X6  826936-5  [T_TYCO_826936-5]
X10  12401598E4#2A  [CON-AMPHENOL-12401598E4#2A]  (parts A,B of 2)

### Blocks framed on the sheet
UV/OV/OC/REVERSE PROTECTION: C95 C104 C105 C108 C247-C264 D30 D31 IC18 JP4 L20 LED8 R134-R140 R143 R144 T17-T20
POWER OUTPUT HEADER: C225-C227 X6
SHARED PADS: R149 R150
USB-C POWER IN: C61 C110-C115 C117 C124-C130 D24 D26 D32 D33 IC20 IC22 IC23 L48 LED10-LED13 LED22 LED29 R44 R48 R77 R81 R108 R152 R154 R156 R159-R166 R169-R171 R173 R175-R178 R180-R184 R187-R190 R193-R196 T8 T21 T23 T25-T27 TP4-TP8 TP19 TP20 X10
POWER SUPPLY INDICATIONS: LED14-LED17 R185 R186 R191 R192 T29
USB-C STANDBY VOLTAGE LDO: C131 C132 IC24

### Ports
I2C_1[0..1] (bidir)

### Nets
+V1.8_SW: C107.2 C227.2 IC19.1(VCCA) IC19.5(OE) T29.5(G) X6.5
+V3.3: R167.1 R185.1
+V3.3_SW: C106.2 C116.2 C226.2 IC19.8(VCCB) IC21.5(VSS) R141.2 R142.2 R149.2 R153.2 R191.1 R192.1 X6.4
+V5_PD: C111.2 C112.2 C132.2 IC24.3(Vout) LED10.A R77.1 R81.1 R152.2 R154.2 R156.2 R166.2 R171.2 R173.1 R182.1
+V5_SW: C225.2 R186.2 X6.3
+V_BUS_PD: C110.2 C114.2 C126.2 C131.2 D24.A IC20.11(VIN) IC20.12(VIN) IC23.24(VDD) IC24.1(Vin) L48.2 R44.2 R175.2
+V_PWR_IN_1: C105.2 L20.1
+V_SUPPLY_FILT: C113.1 C247.2 C248.2 C249.2 C250.2 C251.2 C252.2 C253.2 C254.2 C255.2 C256.2 C257.2 C258.2 C259.2 C260.2 C261.2 C262.2 C263.2 C264.2 IC20.1(VOUT) IC20.2(VOUT) R135.4 R183.2
+V_SUPPLY_FILT_SW: X6.1
+VREG_1V2: C125.1 IC23.21(VREG_1V2)
+VREG_2V7: C61.1 IC23.23(VREG_2V7) R108.2 R184.2 R187.1 R188.1 R189.1 R194.2 R195.2
GND: BAT1.2(-) C61.2 C95.1 C104.1 C105.1 C106.1 C107.1 C108.2 C110.1 C111.1 C112.1 C113.2 C114.1 C115.1 C116.1 C117.1 C118.1 C119.1 C120.1 C121.1 C122.1 C123.1 C124.1 C125.2 C126.1 C127.1 C128.1 C129.2 C130.1 C131.1 C132.1 C225.1 C226.1 C227.1 C247.1 C248.1 C249.1 C250.1 C251.1 C252.1 C253.1 C254.1 C255.1 C256.1 C257.1 C258.1 C259.1 C260.1 C261.1 C262.1 C263.1 C264.1 D26.3 D32.2(A) D33.2(A) IC18.5(GND) IC18.11(GND-PAD) IC19.4(GND) IC20.6(GND) IC21.6(GND) IC22.6(GND) IC23.10(GND) IC23.25(EP) IC24.2(GND) IC24.4(GND) JP4.3 LED11.K LED14.K LED15.K LED16.K R144.1 R150.2 R155.2 R163.1 R165.1 R169.1 R170.1 R178.1 R181.1 R190.2 R193.1 R196.1 T8.2(S) T21.2(S) T23.2(S) T25.2(S) T26.2(S) T27.2(S) T29.1(S) T29.2(G) T29.4(S) X1.10(GND) X1.11(GND) X1.18(GND) X1.27(GND) X1.28(GND) X1.33(GND) X1.39(GND) X1.40(GND) X1.45(GND) X1.50(GND) X1.51(GND) X1.65(GND) X1.68(GND) X1.71(GND) X1.77(GND) X1.83(GND) X1.86(GND) X1.89(GND) X1.97(GND) X1.98(GND) X1.103(GND) X1.109(GND) X1.110(GND) X1.115(GND) X1.121(GND) X1.122(GND) X1.127(GND) X1.134(GND) X1.145(GND) X1.146(GND) X1.158(GND) X1.167(GND) X1.170(GND) X1.173(GND) X1.179(GND) X1.182(GND) X1.194(GND) X1.195(GND) X1.204(GND) X1.209(GND) X1.223(GND) X1.224(GND) X1.229(GND) X1.230(GND) X1.236(GND) X1.242(GND) X1.243(GND) X6.2 X10.A1(GND) X10.A12(GND) X10.B1(GND) X10.B12(GND)
GND_CHASSIS: C130.2 R193.2 X10.SH1(SHIELD) X10.SH2(SHIELD) X10.SH3(SHIELD) X10.SH4(SHIELD)
+V_BAT: BAT1.1(+) R179.2
+V_PWR_IN_2: C115.2 L48.1 X10.A4(VBUS) X10.A9(VBUS) X10.B4(VBUS) X10.B9(VBUS)
FAULT: R184.1 T8.3(D) T27.1(G)
I2C_1_SCL: R145.1 R177.1
I2C_1_SDA: R146.1 R180.1
PWR_IN_1_FILT: C95.2 IC18.1(Vin) L20.2 R134.2 R138.2 T17.5(D) T17.6(D) T17.7(D) T17.8(D)
PWR_IN_2_CC1: C127.2 D26.2 IC23.1(CC1DB) IC23.2(CC1) X10.A5(CC1)
PWR_IN_2_CC2: C128.2 D26.1 IC23.4(CC2) IC23.5(CC2DB) X10.B5(CC2)
THERMAL: IC20.13(EXP)
USB_CHG_CON_N: D33.1(C) R161.2 X10.A7(DN1) X10.B7(DN2)
USB_CHG_CON_P: D32.1(C) R160.2 X10.A6(DP1) X10.B6(DP2)
USB_CHG_N: IC22.8(DM_CON) R161.1
USB_CHG_P: IC22.7(DP_CON) R160.1
VBUS_EN_SNK: R166.1 T23.1(G) T25.1(G) T26.3(D)
VCC: C118.2 C119.2 C120.2 C121.2 C122.2 C123.2 R167.4 TP12.1 X1.251(VCC) X1.253(VCC) X1.255(VCC) X1.257(VCC) X1.259(VCC)
VCC_BACKUP: R179.1 X1.249(VCC_BACKUP)
NetC104_2: C104.2 R136.1
NetC108_1: C108.1 JP4.1
NetC109_1: C109.1 IC21.7(VIN-) R158.2
NetC109_2: C109.2 IC21.8(VIN+) R157.2
NetC117_2: C117.2 IC20.7(SS)
NetC124_2: C124.2 IC23.22(VSYS) R169.2 R171.1
NetC129_1: C129.1 D24.C R44.1 R48.2
NetD30_A: D30.A R134.1
NetD30_C: D30.C R137.2 T19.3(C)
NetD31_1: D31.1(C) IC18.10(GATE) R136.2 T17.4(G) T18.4(G)
NetD31_2: D31.2(A) T17.1(S) T17.2(S) T17.3(S) T18.1(S) T18.2(S) T18.3(S)
NetIC18_2: IC18.2(UV) R140.1 R143.2
NetIC18_3: IC18.3(OV) R143.1 R144.2
NetIC18_4: IC18.4(RETRY) JP4.2
NetIC18_6: IC18.6(~{SHDN}) R138.1 R140.2
NetIC18_7: IC18.7(~{FAULT}) LED8.K
NetIC18_8: IC18.8(Vout) R135.3
NetIC18_9: IC18.9(SENSE) R135.2
NetIC19_2: IC19.2(A0) R145.2
NetIC19_3: IC19.3(A1) R146.2
NetIC19_6: IC19.6(B1) IC21.3(SDA) R142.1
NetIC19_7: IC19.7(B0) IC21.4(SCL) R141.1
NetIC20_3: IC20.3(POVP) R165.2
NetIC20_4: IC20.4(FLTB) R159.2
NetIC20_5: IC20.5(ENB) R152.1 T21.3(D) T23.3(D)
NetIC21_1: IC21.1(A1) R153.1 R155.1
NetIC21_2: IC21.2(A0) R149.1 R150.1
NetIC22_2: IC22.2(DM_HOST) TP19.1
NetIC22_3: IC22.3(DP_HOST) TP20.1
NetIC22_5: IC22.5(GOOD_BAT) R156.1
NetIC22_9: IC22.9(VBUS) R154.1
NetIC22_10: IC22.10(CHG_DET) R162.1 R164.2
NetIC23_3: IC23.3(NC) R170.2
NetIC23_6: IC23.6(RESET) R190.1
NetIC23_7: IC23.7(SCL) R177.2 TP7.1
NetIC23_8: IC23.8(SDA) R180.2 TP8.1
NetIC23_9: IC23.9(DISCH) R183.1
NetIC23_11: IC23.11(ATTACH#) R189.2 TP6.1
NetIC23_12: IC23.12(ADDR0) R181.2 R195.1
NetIC23_13: IC23.13(ADDR1) R194.1 R196.2
NetIC23_14: IC23.14(POWER_OK3#) LED29.K R188.2 TP5.1
NetIC23_15: IC23.15(GPIO) R108.1 T8.1(G)
NetIC23_16: IC23.16(VBUS_EN_SNK#) R176.2
NetIC23_18: IC23.18(VBUS_VS_DISCH) R48.1
NetIC23_20: IC23.20(POWER_OK2#) LED22.K R187.2 TP4.1
NetLED8_A: LED8.A R139.1 T20.2(E)
NetLED10_K: LED10.K R159.1
NetLED11_A: LED11.A R164.1
NetLED12_A: LED12.A R173.2
NetLED12_K: LED12.K T25.3(D)
NetLED13_A: LED13.A R182.2
NetLED13_K: LED13.K T27.3(D)
NetLED14_A: LED14.A R185.2
NetLED15_A: LED15.A R186.1
NetLED16_A: LED16.A R191.2
NetLED17_A: LED17.A R192.2
NetLED17_K: LED17.K T29.3(D)
NetLED22_A: LED22.A R77.2
NetLED29_A: LED29.A R81.2
NetR135_1: R135.1 T18.5(D) T18.6(D) T18.7(D) T18.8(D)
NetR137_1: R137.1 T19.1(B) T20.3(C)
NetR139_2: R139.2 T19.2(E) T20.1(B)
NetR157_1: R157.1 R167.2 TP10.1
NetR158_1: R158.1 R167.3 TP11.1
NetR162_2: R162.2 R163.2 T21.1(G)
NetR175_1: R175.1 R176.1 R178.2 T26.1(G)

Not connected (* = marked no-connect by the designer): IC20 8(NC)* 9(NC)* 10(NC)*; IC22 1(SW_OPEN)* 4(CHG_AL_N)*; IC23 17(A_B_SIDE#)* 19(ALERT#)*; T29 6(D)*; X10 A2(SSTXP1)* A3(SSTXN1)* A8(SBU1)* A10(SSRXN2)* A11(SSRXP2)* B2(SSTXP2)* B3(SSTXN2)* B8(SBU2)* B10(SSRXN1) B11(SSRXP1)*

### Buses and harness runs
bus I2C_1[0..1] = port I2C_1[0..1]

### Notes on the sheet
- POWER IN
- SOM POWER SUPPLY
- Alvaro Flor
- INA219 Slave address
- LOW
- HIGH
- A1
- A0
- I2C Address[7:1]
- 1000000
- 1000001
- 1000100
- R/W
- [0]
- Text
- OV - 24V
  UV - 5V
- 1000101
- (near R155) SHARED PADS
- Place near SODIMM Pins 251, 259
- BACK-UP BATTERY
- EXP (pin 13)
  . Solder to a metal surface directly underneath EXP and connect to floating Cu thermal pads on multiple PCB layers through vias. For best ther-mal performance make the floating Cu floating pads as large as possible and connect to EXP with multiple vias
- STUSB4500 Slave address
- 0101000
- 0101001
- 0101010
- 0101011
- Title
- Size:
- Date:
- A3
- Number:
- Time:
- Revision:
- Sheet
- of
- File:

### Library data of the parts
BAT1 = BAT-Keystone-3000: Battery Holder; Manufacturer Part No.: 3000; Manufacturer Name: Keystone
C61 C125 C129 = C-X5R-1uF-16V-20%-0402: Capacitor Ceramic X5R 1uF 16V 20% 0402; Tolerance: 20%; Type: X5R; Value: 1uF
C95 C114 C247-C264 = C-X5R-10uF-50V-20%-1206: Capacitor Ceramic X5R 10uF 50V 20% 1206; Tolerance: 20%; Type: X5R; Value: 10uF
C104 = C-X7R-5.6n-100V-10%-1206: Capacitor Ceramic X7R 5.6nF 100V 10% 1206; Tolerance: 10%; Type: X7R; Value: 5.6nF
C105 C110 C113 C115 C131 = C-X7R-100nF-50V-10%-0402: Capacitor Ceramic X7R 100nF 50V 10% 0402; Tolerance: 10%; Type: X7R; Value: 100nF
C106-C109 C112 C116 C124 C126 C225-C227 = C-X7R-100nF-16V-10%-0402: Capacitor Ceramic X7R 100nF 16V 10% 0402; Tolerance: 10%; Type: X7R; Value: 100nF
C111 C119-C123 = C-X5R-4.7uF-10V-10%-0603: Capacitor Ceramic X5R 4.7uF 10V 10% 0603; Tolerance: 10%; Type: X5R; Value: 4.7uF; ClassName: Power_Poly
C117 = C-X7R-10nF-50V-10%-0402: Capacitor Ceramic X7R 10nF 50V 10% 0402; Tolerance: 10%; Type: X7R; Value: 10nF
C118 = C-X5R-22uF-10V-20%-0805: Capacitor Ceramic X5R 22uF 10V 20% 0805; Tolerance: 20%; Type: X5R; Value: 22uF; ClassName: Power_Poly
C127 C128 = C-X7R-330pF-50V-10%-0402: Capacitor Ceramic X7R 330pF 50V 10% 0402; Tolerance: 10%; Type: X7R; Value: 330pF
C130 = C-X7R-1nF-2KV-10%-1206: Capacitor Ceramic X7R 1nF 2KV 10% 1206; Tolerance: 10%; Type: X7R; Value: 1nF
C132 = C-X5R-10uF-10V-20%-0603: Capacitor Ceramic X5R 10uF 10V 20% 0603; Tolerance: 20%; Type: X5R; Value: 10uF
D24 D30 = D-OnSemi-1N4148WT: as D20 on sheet Power_Switch; Manufacturer Part No.: 1N4148WT
D26 = D-Nexperia-PESD2IVN24-T: TVS Array low cap; Manufacturer Name: Nexperia; Manufacturer Part No.: PESD2IVN24-T
D31 = D-OnSemi-MM3Z10VT1G: as D27 on sheet Power_Switch; Manufacturer Part No.: MM3Z10VT1G
D32 D33 = D-OnSemi-ESD9101P2T5G: as D21 on sheet Power_Switch; Manufacturer Part No.: ESD9101P2T5G
IC18 = IC-LIN-LTC4368IDD-2#PBF: Reverse Protection Controller with Bidirectional Circuit Breaker; Manufacturer Name: Linear; Package: *; Temperature Range: *; Manufacturer Part No.: LTC4368IDD-2#PBF
IC19 = IC-ONsemi-FXMA2102L8X: Voltage Level Translator for I2C Applications; Manufacturer Name: ONSemi; Manufacturer Part No.: FXMA2102L8X
IC20 = IC-A&O-AOZ1327DI-01: 20V Protection Switch with True Reverse Current Blocking; Manufacturer Name: Alpha and Omega; Manufacturer Part No.: AOZ1327DI-01
IC21 = IC-TI-INA219BIDR: CURRENT/POWER MONITOR with I2C Interface; Manufacturer Name: Texas Instruments
IC22 = IC-TI-BQ24392RSER: USB Charger Detection; Manufacturer Name: Texas Instruments; Manufacturer Part No.: BQ24392RSER
IC23 = IC-ST-STUSB4500QTR: Standalone USB PD sink controller with short-to-VBUS protections; Manufacturer Name: ST; Temperature Range: -40C to +105C; Package: 24-QFN-EP (4x4); Manufacturer Part No.: STUSB4500QTR
IC24 = IC-ON-NCV4274CST50T3G: as IC11 on sheet Power_Switch; Manufacturer Part No.: NCV4274CST50T3G
JP4 = CON-Tyco-826936-3-1X3-2.54mm-JP_1: Jumper, 3-Pin; Manufacturer Name: Tyco; No. of ways: 1X3; Pitch: 2.54mm; Manufacturer Part No.: 826936-3
L20 L48 = L-Laird-35F0121-0SR-10-10A-25%: Power Supply FB 10A; Tolerance: 25%; Rating: 10A; Value: 36R@100MHz; ClassName: Power_Poly
LED8 LED10 LED13 = LED-LiteOn-LTST-C190KRKT: LED red, Lite-On LTST-C190KRKT; Manufacturer Part No.: LTST-C190KRKT; Manufacturer Name: Lite-On
LED11 LED12 LED14-LED17 LED22 LED29 = LED-LiteOn-LTST-C190GKT: LED green Lite-ON LTST-C190GKT; Manufacturer Name: Lite-ON; Manufacturer Part No.: LTST-C190GKT
R44 = R-470R-63mW-1%-0603: Resistor 470 Ohm 63mW 1% 0603; Rating: 63mW; Tolerance: 1%; Value: 470R
R48 R176 R183 = R-1K-63mW-5%-0603: Resistor 1 Kohm 63mW 5% 0603; Rating: 63mW; Tolerance: 5%; Value: 1K
R77 R81 R159 R164 R173 R182 R186 = R-2.2K-63mW-5%-0402: as R97 on sheet Power_Switch; Rating: 63mW; Tolerance: 5%
R108 R137 R152 R163 R166 R175 R178 R181 R184 R187-R190 R196 = R-100K-63mW-5%-0402: Resistor 100 Kohm 63mW 5% 0402; Rating: 63mW; Tolerance: 5%; Value: 100K
R134 R179 R185 R191 R192 = R-1K-63mW-5%-0402: Resistor 1 Kohm 63mW 5% 0402; Rating: 63mW; Tolerance: 5%; Value: 1K
R135 R167 = R-Vishay-WSK1206R0100FEA18: 10 mOhms ±1% 0.5W,Chip Resistor 1206 (3216 Metric) Current Sense, Moisture Resistant, Pulse Withstanding Metal Element; Manufacturer Name: Vishay; Rating: 0.5W; Tolerance: 1%; Value: 0.01R; Manufacturer Part No.: WSK1206R0100FEA18; ClassName: Power_Poly
R136 = R-22K-250mW-1%-1206: Resistor 22 Kohm 250mW 1% 1206; Rating: 250mW; Tolerance: 1%; Value: 22K
R138 = R-300K-250mW-1%-1206: Resistor 300 Kohm 250mW 1% 1206; Rating: 250mW; Tolerance: 1%; Value: 300K
R139 = R-330R-63mW-5%-0402: Resistor 330 ohm 63mW 5% 0402; Rating: 63mW; Tolerance: 5%; Value: 330R
R140 = R-412K-250mW-1%-1206: Resistor 412 Kohm 250mW 1% 1206; Rating: 250mW; Tolerance: 1%; Value: 412K
R141 R142 R156 = R-10K-63mW-5%-0402: Resistor 10 Kohm 63mW 5% 0402; Rating: 63mW; Tolerance: 5%; Value: 10K
R143 = R-84.5K-250mW-1%-1206: Resistor 84.5 Kohm 250mW 1% 1206; Rating: 250mW; Tolerance: 1%; Value: 84.5K
R144 = R-15K-250mW-1%-1206: Resistor 15 Kohm 250mW 1% 1206; Rating: 250mW; Tolerance: 1%; Value: 15K
R145 R146 R149 R150 R153 R155 R162 R165 R169-R171 R177 R180 R194 R195 = R-0R-63mW-1%-0603: Resistor 0 ohm 63mW 1% 0603; Rating: 63mW; Tolerance: 1%; Value: 0R
R154 R160 R161 = R-2.2R-63mW-5%-0603: Resistor 2.2 ohm 63mW 5% 0603; Rating: 63mW; Tolerance: 5%; Value: 2.2R
R157 R158 = R-10R-63mW-5%-0402: Resistor 10 ohm 63mW 5% 0402; Rating: 63mW; Tolerance: 5%; Value: 10R
R193 = R-1M-250mW-5%-1206: Resistor 1 Mohm 250mW 5% 1206; Rating: 250mW; Tolerance: 5%; Value: 1M
T8 T21 T23 T25-T27 = T-Diodes-BSS138-7-F: as T13 on sheet Power_Switch; Manufacturer Part No.: BSS138-7-F
T17 T18 = T-ONSemi-NTMFS5C670NLT1G: MOSFET N-CH 60V 68A SO8FL; Manufacturer Name: ONSemi; Manufacturer Part No.: NTMFS5C670NLT1G
T19 T20 = T-ONSemi-MMBT5551LT1G -SOT-23: Bipolar Transistor NPN 160V 600mA  225mW Surface Mount SOT-23-3; Manufacturer Name: ONSemi; Manufacturer Part No.: MMBT5551LT1G
T29 = T-ONSemi-NTZD3154NT1G: as T9 on sheet Power_Switch
TP4-TP8 TP10-TP12 TP19 TP20 = Testpin-THT: Testpin THT
X1 = CON-TE-2309409-2: as X1 on sheet Power_Switch; Temperature Range: -40C to +125C; Package: DDR4-SODIMM-260; Manufacturer Part No.: 2309409-2
X6 = CON-Tyco-826936-5-1X5-2.54mm: Header, 5-Pin; Manufacturer Name: Tyco; No. of ways: 1X5; Pitch: 2.54mm; Manufacturer Part No.: 826936-5
X10 = CON-Amphenol-12401598E4#2A: USB 3.1 Gen 2, Input Output Connectors, USB type C, Receptacle, Top mount, dual-row SMT, 1.6mmPCB; No. of ways: 24; Manufacturer Name: Amphenol; Manufacturer Part No.: 12401598E4#2A